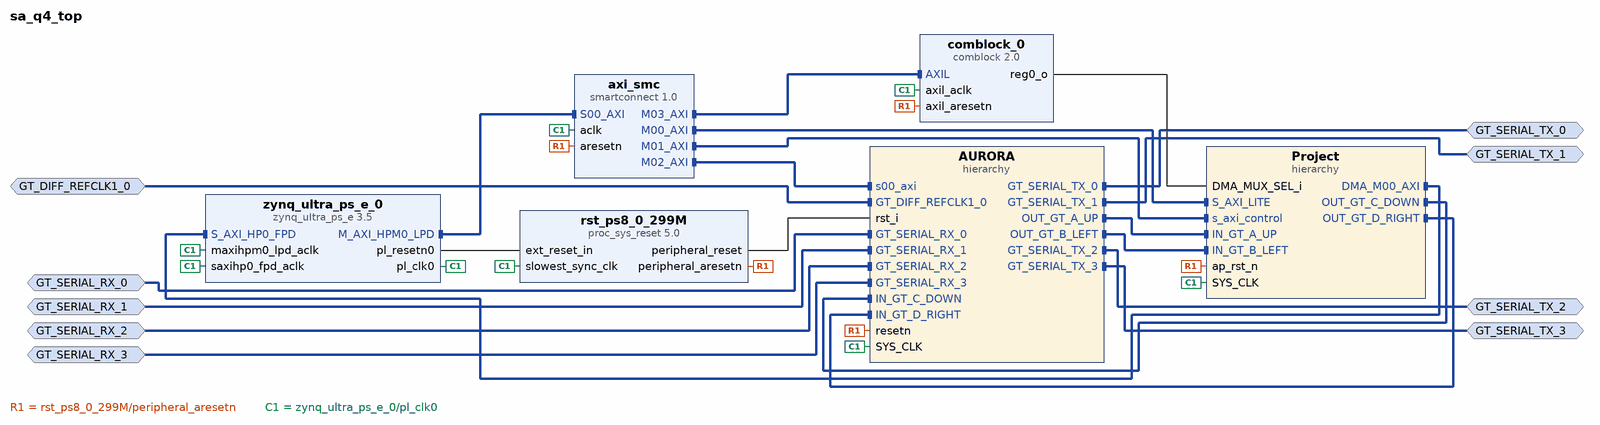
[diagram p0: block diagram of the top level]
# Vivado block design sa_q4_top, xczu4eg-sfvc784-2-e, Vivado 2024.2
create_bd_design sa_q4_top

create_bd_intf_port -mode Slave -vlnv xilinx.com:display_aurora:GT_Serial_Transceiver_Pins_RX_rtl:1.0 GT_SERIAL_RX_0
create_bd_intf_port -mode Master -vlnv xilinx.com:display_aurora:GT_Serial_Transceiver_Pins_TX_rtl:1.0 GT_SERIAL_TX_0
create_bd_intf_port -mode Slave -vlnv xilinx.com:display_aurora:GT_Serial_Transceiver_Pins_RX_rtl:1.0 GT_SERIAL_RX_1
create_bd_intf_port -mode Master -vlnv xilinx.com:display_aurora:GT_Serial_Transceiver_Pins_TX_rtl:1.0 GT_SERIAL_TX_1
create_bd_intf_port -mode Slave -vlnv xilinx.com:display_aurora:GT_Serial_Transceiver_Pins_RX_rtl:1.0 GT_SERIAL_RX_2
create_bd_intf_port -mode Master -vlnv xilinx.com:display_aurora:GT_Serial_Transceiver_Pins_TX_rtl:1.0 GT_SERIAL_TX_2
create_bd_intf_port -mode Slave -vlnv xilinx.com:display_aurora:GT_Serial_Transceiver_Pins_RX_rtl:1.0 GT_SERIAL_RX_3
create_bd_intf_port -mode Master -vlnv xilinx.com:display_aurora:GT_Serial_Transceiver_Pins_TX_rtl:1.0 GT_SERIAL_TX_3
create_bd_intf_port -mode Slave -vlnv xilinx.com:interface:diff_clock_rtl:1.0 GT_DIFF_REFCLK1_0
set_property -dict {CONFIG.FREQ_HZ 125000000} [get_bd_intf_ports GT_DIFF_REFCLK1_0]

create_bd_cell -type ip -vlnv xilinx.com:ip:proc_sys_reset:5.0 rst_ps8_0_299M
create_bd_cell -type ip -vlnv xilinx.com:ip:zynq_ultra_ps_e:3.5 zynq_ultra_ps_e_0
set_property -dict [list \
  CONFIG.PSU_BANK_0_IO_STANDARD LVCMOS18 \
  CONFIG.PSU_BANK_1_IO_STANDARD LVCMOS18 \
  CONFIG.PSU_BANK_2_IO_STANDARD LVCMOS18 \
  CONFIG.PSU_BANK_3_IO_STANDARD LVCMOS18 \
  CONFIG.PSU__CAN1__PERIPHERAL__ENABLE 1 \
  CONFIG.PSU__CAN1__PERIPHERAL__IO {MIO 52 .. 53} \
  CONFIG.PSU__CRF_APB__DDR_CTRL__FREQMHZ 1200 \
  CONFIG.PSU__CRF_APB__DP_AUDIO_REF_CTRL__SRCSEL VPLL \
  CONFIG.PSU__CRF_APB__DP_STC_REF_CTRL__SRCSEL VPLL \
  CONFIG.PSU__CRF_APB__DP_VIDEO_REF_CTRL__SRCSEL DPLL \
  CONFIG.PSU__CRF_APB__GPU_REF_CTRL__FREQMHZ 600 \
  CONFIG.PSU__CRF_APB__GPU_REF_CTRL__SRCSEL DPLL \
  CONFIG.PSU__CRF_APB__TOPSW_MAIN_CTRL__SRCSEL VPLL \
  CONFIG.PSU__CRL_APB__ADMA_REF_CTRL__SRCSEL IOPLL \
  CONFIG.PSU__CRL_APB__CAN1_REF_CTRL__SRCSEL IOPLL \
  CONFIG.PSU__CRL_APB__CPU_R5_CTRL__SRCSEL IOPLL \
  CONFIG.PSU__CRL_APB__IOU_SWITCH_CTRL__SRCSEL RPLL \
  CONFIG.PSU__CRL_APB__LPD_SWITCH_CTRL__SRCSEL IOPLL \
  CONFIG.PSU__CRL_APB__PL0_REF_CTRL__FREQMHZ 300 \
  CONFIG.PSU__CRL_APB__PL0_REF_CTRL__SRCSEL IOPLL \
  CONFIG.PSU__CRL_APB__SDIO1_REF_CTRL__SRCSEL RPLL \
  CONFIG.PSU__DDRC__DEVICE_CAPACITY {8192 MBits} \
  CONFIG.PSU__DDRC__DRAM_WIDTH {16 Bits} \
  CONFIG.PSU__DDRC__SPEED_BIN DDR4_2400P \
  CONFIG.PSU__DDR_HIGH_ADDRESS_GUI_ENABLE 1 \
  CONFIG.PSU__DDR__INTERFACE__FREQMHZ 600.000 \
  CONFIG.PSU__DLL__ISUSED 1 \
  CONFIG.PSU__ENET3__FIFO__ENABLE 0 \
  CONFIG.PSU__ENET3__GRP_MDIO__ENABLE 1 \
  CONFIG.PSU__ENET3__GRP_MDIO__IO {MIO 76 .. 77} \
  CONFIG.PSU__ENET3__PERIPHERAL__ENABLE 1 \
  CONFIG.PSU__ENET3__PERIPHERAL__IO {MIO 64 .. 75} \
  CONFIG.PSU__ENET3__PTP__ENABLE 0 \
  CONFIG.PSU__ENET3__TSU__ENABLE 0 \
  CONFIG.PSU__FPGA_PL0_ENABLE 1 \
  CONFIG.PSU__GEM3_COHERENCY 0 \
  CONFIG.PSU__GEM3_ROUTE_THROUGH_FPD 0 \
  CONFIG.PSU__GEM__TSU__ENABLE 0 \
  CONFIG.PSU__GPIO0_MIO__IO {MIO 0 .. 25} \
  CONFIG.PSU__GPIO0_MIO__PERIPHERAL__ENABLE 1 \
  CONFIG.PSU__GPIO1_MIO__IO {MIO 26 .. 51} \
  CONFIG.PSU__GPIO1_MIO__PERIPHERAL__ENABLE 1 \
  CONFIG.PSU__GPIO2_MIO__IO {MIO 52 .. 77} \
  CONFIG.PSU__GPIO2_MIO__PERIPHERAL__ENABLE 1 \
  CONFIG.PSU__I2C0__PERIPHERAL__ENABLE 1 \
  CONFIG.PSU__I2C0__PERIPHERAL__IO {MIO 38 .. 39} \
  CONFIG.PSU__I2C1__PERIPHERAL__ENABLE 0 \
  CONFIG.PSU__PCIE__BAR0_ENABLE 1 \
  CONFIG.PSU__PCIE__BAR0_SCALE Megabytes \
  CONFIG.PSU__PCIE__BAR0_SIZE 1 \
  CONFIG.PSU__PCIE__BAR0_TYPE Memory \
  CONFIG.PSU__PCIE__BAR0_VAL 0xfff00000 \
  CONFIG.PSU__PCIE__BAR1_VAL 0x0 \
  CONFIG.PSU__PCIE__BAR2_VAL 0x0 \
  CONFIG.PSU__PCIE__BAR3_VAL 0x0 \
  CONFIG.PSU__PCIE__BAR4_VAL 0x0 \
  CONFIG.PSU__PCIE__BAR5_VAL 0x0 \
  CONFIG.PSU__PCIE__BRIDGE_BAR_INDICATOR {BAR 0} \
  CONFIG.PSU__PCIE__CLASS_CODE_BASE 0x05 \
  CONFIG.PSU__PCIE__CLASS_CODE_INTERFACE 0x0 \
  CONFIG.PSU__PCIE__CLASS_CODE_SUB 0x04 \
  CONFIG.PSU__PCIE__CLASS_CODE_VALUE 0x50400 \
  CONFIG.PSU__PCIE__DEVICE_ID 0xD021 \
  CONFIG.PSU__PCIE__DEVICE_PORT_TYPE {Endpoint Device} \
  CONFIG.PSU__PCIE__EROM_VAL 0x0 \
  CONFIG.PSU__PCIE__INTX_GENERATION 1 \
  CONFIG.PSU__PCIE__INTX_PIN INTA \
  CONFIG.PSU__PCIE__LANE0__ENABLE 1 \
  CONFIG.PSU__PCIE__LANE0__IO {GT Lane0} \
  CONFIG.PSU__PCIE__LANE1__ENABLE 1 \
  CONFIG.PSU__PCIE__LANE1__IO {GT Lane1} \
  CONFIG.PSU__PCIE__LANE2__ENABLE 1 \
  CONFIG.PSU__PCIE__LANE2__IO {GT Lane2} \
  CONFIG.PSU__PCIE__LANE3__ENABLE 1 \
  CONFIG.PSU__PCIE__LANE3__IO {GT Lane3} \
  CONFIG.PSU__PCIE__LINK_SPEED {5.0 Gb/s} \
  CONFIG.PSU__PCIE__MAXIMUM_LINK_WIDTH x4 \
  CONFIG.PSU__PCIE__MAX_PAYLOAD_SIZE {256 bytes} \
  CONFIG.PSU__PCIE__MSIX_BAR_INDICATOR {BAR 0} \
  CONFIG.PSU__PCIE__MSIX_PBA_BAR_INDICATOR {BAR 0} \
  CONFIG.PSU__PCIE__PERIPHERAL__ENABLE 1 \
  CONFIG.PSU__PCIE__PERIPHERAL__ENDPOINT_IO {MIO 37} \
  CONFIG.PSU__PCIE__REF_CLK_FREQ 100 \
  CONFIG.PSU__PCIE__REF_CLK_SEL {Ref Clk0} \
  CONFIG.PSU__PCIE__REVISION_ID 0x0 \
  CONFIG.PSU__PCIE__SUBSYSTEM_ID 0x7 \
  CONFIG.PSU__PCIE__SUBSYSTEM_VENDOR_ID 0x10EE \
  CONFIG.PSU__PCIE__VENDOR_ID 0x10EE \
  CONFIG.PSU__PRESET_APPLIED 1 \
  CONFIG.PSU__PSS_REF_CLK__FREQMHZ 33.33333 \
  CONFIG.PSU__QSPI_COHERENCY 0 \
  CONFIG.PSU__QSPI_ROUTE_THROUGH_FPD 0 \
  CONFIG.PSU__QSPI__GRP_FBCLK__ENABLE 1 \
  CONFIG.PSU__QSPI__GRP_FBCLK__IO {MIO 6} \
  CONFIG.PSU__QSPI__PERIPHERAL__DATA_MODE x4 \
  CONFIG.PSU__QSPI__PERIPHERAL__ENABLE 1 \
  CONFIG.PSU__QSPI__PERIPHERAL__IO {MIO 0 .. 12} \
  CONFIG.PSU__QSPI__PERIPHERAL__MODE {Dual Parallel} \
  CONFIG.PSU__SD1_COHERENCY 0 \
  CONFIG.PSU__SD1_ROUTE_THROUGH_FPD 0 \
  CONFIG.PSU__SD1__CLK_50_SDR_ITAP_DLY 0x15 \
  CONFIG.PSU__SD1__CLK_50_SDR_OTAP_DLY 0x5 \
  CONFIG.PSU__SD1__DATA_TRANSFER_MODE 4Bit \
  CONFIG.PSU__SD1__GRP_CD__ENABLE 1 \
  CONFIG.PSU__SD1__GRP_CD__IO {MIO 45} \
  CONFIG.PSU__SD1__GRP_POW__ENABLE 0 \
  CONFIG.PSU__SD1__GRP_WP__ENABLE 0 \
  CONFIG.PSU__SD1__PERIPHERAL__ENABLE 1 \
  CONFIG.PSU__SD1__PERIPHERAL__IO {MIO 46 .. 51} \
  CONFIG.PSU__SD1__SLOT_TYPE {SD 2.0} \
  CONFIG.PSU__SWDT0__CLOCK__ENABLE 0 \
  CONFIG.PSU__SWDT0__PERIPHERAL__ENABLE 1 \
  CONFIG.PSU__SWDT0__RESET__ENABLE 0 \
  CONFIG.PSU__SWDT1__CLOCK__ENABLE 0 \
  CONFIG.PSU__SWDT1__PERIPHERAL__ENABLE 1 \
  CONFIG.PSU__SWDT1__RESET__ENABLE 0 \
  CONFIG.PSU__TSU__BUFG_PORT_PAIR 0 \
  CONFIG.PSU__TTC0__CLOCK__ENABLE 0 \
  CONFIG.PSU__TTC0__PERIPHERAL__ENABLE 1 \
  CONFIG.PSU__TTC0__WAVEOUT__ENABLE 0 \
  CONFIG.PSU__TTC1__CLOCK__ENABLE 0 \
  CONFIG.PSU__TTC1__PERIPHERAL__ENABLE 1 \
  CONFIG.PSU__TTC1__WAVEOUT__ENABLE 0 \
  CONFIG.PSU__TTC2__CLOCK__ENABLE 0 \
  CONFIG.PSU__TTC2__PERIPHERAL__ENABLE 1 \
  CONFIG.PSU__TTC2__WAVEOUT__ENABLE 0 \
  CONFIG.PSU__TTC3__CLOCK__ENABLE 0 \
  CONFIG.PSU__TTC3__PERIPHERAL__ENABLE 1 \
  CONFIG.PSU__TTC3__WAVEOUT__ENABLE 0 \
  CONFIG.PSU__UART0__BAUD_RATE 115200 \
  CONFIG.PSU__UART0__MODEM__ENABLE 0 \
  CONFIG.PSU__UART0__PERIPHERAL__ENABLE 1 \
  CONFIG.PSU__UART0__PERIPHERAL__IO {MIO 42 .. 43} \
  CONFIG.PSU__USB0__PERIPHERAL__ENABLE 0 \
  CONFIG.PSU__USE__S_AXI_GP2 1 \
] [get_bd_cells zynq_ultra_ps_e_0]
# 394 more settings of zynq_ultra_ps_e_0 are not shown: defaults, MIO pin electricals, DDR timing, and values the tool derives
create_bd_cell -type hier AURORA
create_bd_cell -type hier Project
create_bd_cell -type ip -vlnv xilinx.com:ip:smartconnect:1.0 axi_smc
set_property -dict {CONFIG.NUM_MI 5 CONFIG.NUM_SI 1} [get_bd_cells axi_smc]
create_bd_cell -type ip -vlnv www.ictp.it:user:comblock:2.0 comblock_0
set_property -dict {CONFIG.DRAM_IO_ENA false CONFIG.FIFO_IN_ENA false} [get_bd_cells comblock_0]

# ---- hierarchy /AURORA ----
current_bd_instance /AURORA
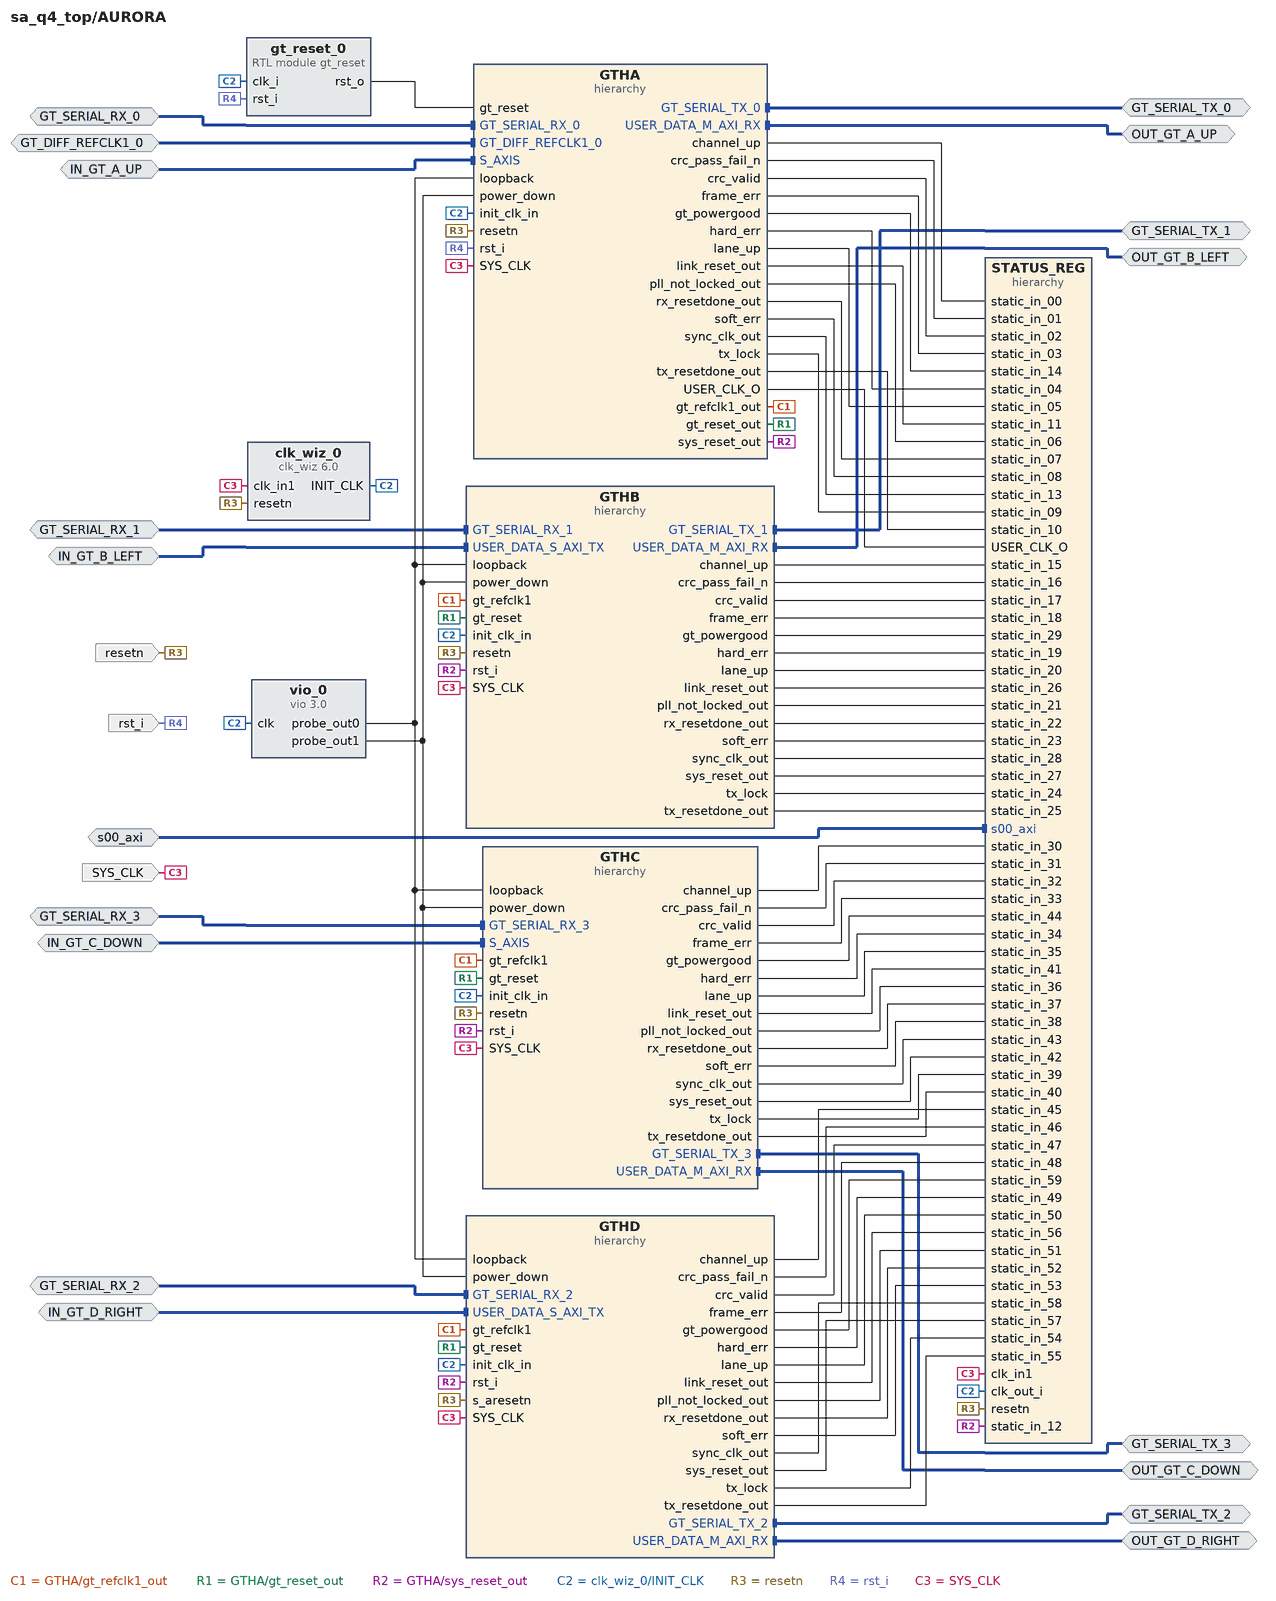
[diagram p1: block diagram inside /AURORA]
create_bd_intf_pin -mode Slave -vlnv xilinx.com:display_aurora:GT_Serial_Transceiver_Pins_RX_rtl:1.0 GT_SERIAL_RX_0
create_bd_intf_pin -mode Master -vlnv xilinx.com:display_aurora:GT_Serial_Transceiver_Pins_TX_rtl:1.0 GT_SERIAL_TX_0
create_bd_intf_pin -mode Slave -vlnv xilinx.com:display_aurora:GT_Serial_Transceiver_Pins_RX_rtl:1.0 GT_SERIAL_RX_1
create_bd_intf_pin -mode Master -vlnv xilinx.com:display_aurora:GT_Serial_Transceiver_Pins_TX_rtl:1.0 GT_SERIAL_TX_1
create_bd_intf_pin -mode Slave -vlnv xilinx.com:display_aurora:GT_Serial_Transceiver_Pins_RX_rtl:1.0 GT_SERIAL_RX_2
create_bd_intf_pin -mode Master -vlnv xilinx.com:display_aurora:GT_Serial_Transceiver_Pins_TX_rtl:1.0 GT_SERIAL_TX_2
create_bd_intf_pin -mode Slave -vlnv xilinx.com:display_aurora:GT_Serial_Transceiver_Pins_RX_rtl:1.0 GT_SERIAL_RX_3
create_bd_intf_pin -mode Master -vlnv xilinx.com:display_aurora:GT_Serial_Transceiver_Pins_TX_rtl:1.0 GT_SERIAL_TX_3
create_bd_intf_pin -mode Slave -vlnv xilinx.com:interface:diff_clock_rtl:1.0 GT_DIFF_REFCLK1_0
create_bd_intf_pin -mode Slave -vlnv xilinx.com:interface:axis_rtl:1.0 IN_GT_D_RIGHT
create_bd_intf_pin -mode Slave -vlnv xilinx.com:interface:axis_rtl:1.0 IN_GT_B_LEFT
create_bd_intf_pin -mode Slave -vlnv xilinx.com:interface:axis_rtl:1.0 IN_GT_C_DOWN
create_bd_intf_pin -mode Slave -vlnv xilinx.com:interface:axis_rtl:1.0 IN_GT_A_UP
create_bd_intf_pin -mode Master -vlnv xilinx.com:interface:axis_rtl:1.0 OUT_GT_A_UP
create_bd_intf_pin -mode Master -vlnv xilinx.com:interface:axis_rtl:1.0 OUT_GT_B_LEFT
create_bd_intf_pin -mode Master -vlnv xilinx.com:interface:axis_rtl:1.0 OUT_GT_C_DOWN
create_bd_intf_pin -mode Master -vlnv xilinx.com:interface:axis_rtl:1.0 OUT_GT_D_RIGHT
create_bd_intf_pin -mode Slave -vlnv xilinx.com:interface:aximm_rtl:1.0 s00_axi
create_bd_pin -dir I -type rst resetn
create_bd_pin -dir I rst_i
create_bd_pin -dir I -type clk SYS_CLK

create_bd_cell -type ip -vlnv xilinx.com:ip:clk_wiz:6.0 clk_wiz_0
set_property -dict [list \
  CONFIG.CLKOUT1_JITTER 191.759 \
  CONFIG.CLKOUT1_PHASE_ERROR 348.339 \
  CONFIG.CLKOUT1_REQUESTED_OUT_FREQ 156.25 \
  CONFIG.CLK_OUT1_PORT INIT_CLK \
  CONFIG.MMCM_CLKFBOUT_MULT_F 96.875 \
  CONFIG.MMCM_CLKOUT0_DIVIDE_F 7.750 \
  CONFIG.MMCM_DIVCLK_DIVIDE 24 \
  CONFIG.RESET_PORT resetn \
  CONFIG.RESET_TYPE ACTIVE_LOW \
] [get_bd_cells clk_wiz_0]
create_bd_cell -type module -reference gt_reset gt_reset_0
create_bd_cell -type ip -vlnv xilinx.com:ip:vio:3.0 vio_0
set_property -dict {CONFIG.C_NUM_PROBE_IN 0 CONFIG.C_NUM_PROBE_OUT 2} [get_bd_cells vio_0]
create_bd_cell -type hier STATUS_REG
create_bd_cell -type hier GTHB
create_bd_cell -type hier GTHC
create_bd_cell -type hier GTHA
create_bd_cell -type hier GTHD

# ---- hierarchy /AURORA/STATUS_REG ----
current_bd_instance /AURORA/STATUS_REG
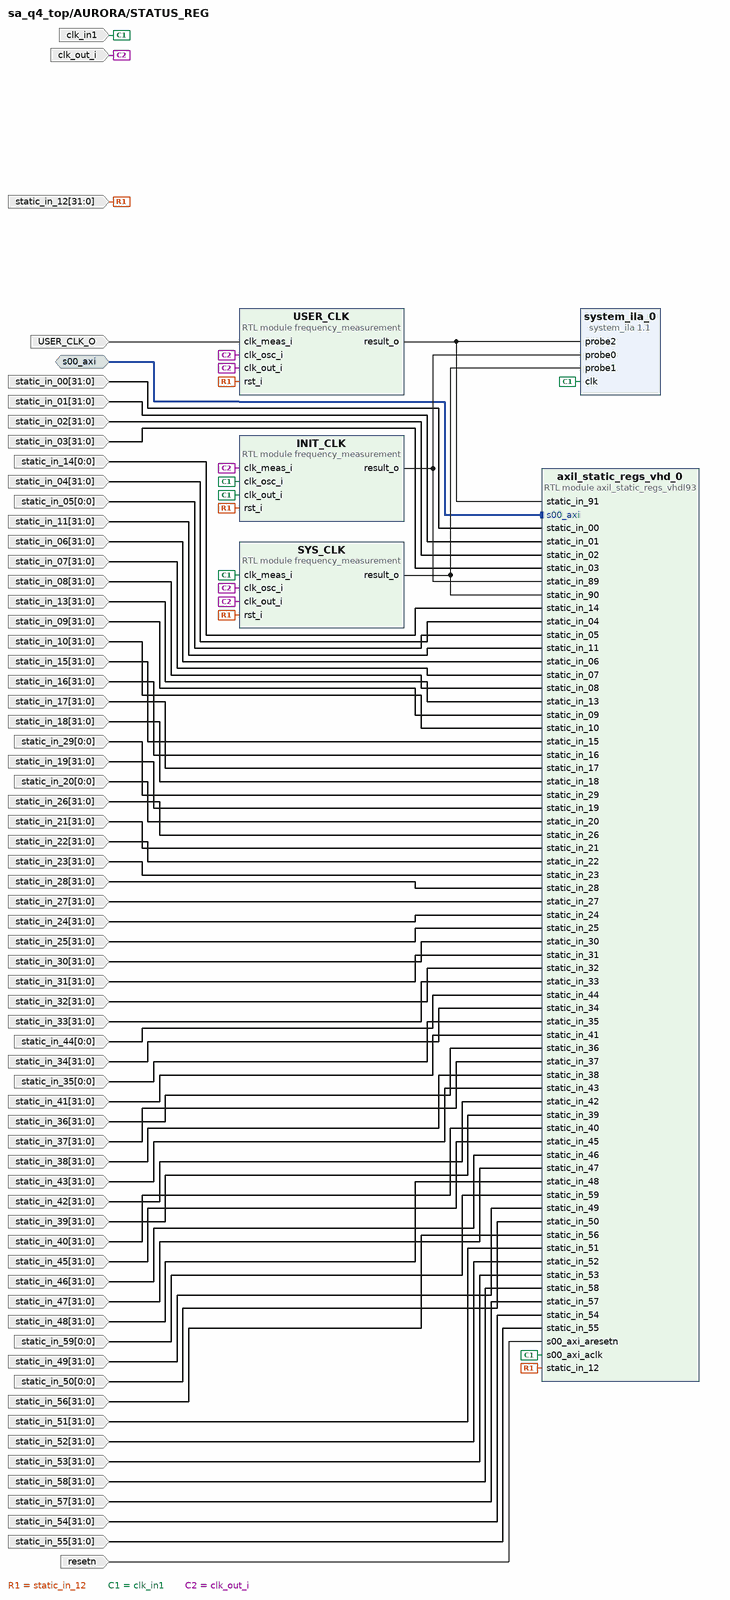
[diagram p2: block diagram inside /AURORA/STATUS_REG]
create_bd_intf_pin -mode Slave -vlnv xilinx.com:interface:aximm_rtl:1.0 s00_axi
create_bd_pin -dir I -from 31 -to 0 static_in_00
create_bd_pin -dir I -from 31 -to 0 static_in_01
create_bd_pin -dir I -from 31 -to 0 static_in_02
create_bd_pin -dir I -from 31 -to 0 static_in_03
create_bd_pin -dir I -from 31 -to 0 static_in_04
create_bd_pin -dir I -from 0 -to 0 static_in_05
create_bd_pin -dir I -from 31 -to 0 static_in_06
create_bd_pin -dir I -from 31 -to 0 static_in_07
create_bd_pin -dir I -from 31 -to 0 static_in_08
create_bd_pin -dir I -from 31 -to 0 static_in_09
create_bd_pin -dir I -from 31 -to 0 static_in_10
create_bd_pin -dir I -from 31 -to 0 static_in_11
create_bd_pin -dir I -from 31 -to 0 static_in_12
create_bd_pin -dir I -from 31 -to 0 static_in_13
create_bd_pin -dir I -from 0 -to 0 static_in_14
create_bd_pin -dir I -from 31 -to 0 static_in_15
create_bd_pin -dir I -from 31 -to 0 static_in_16
create_bd_pin -dir I -from 31 -to 0 static_in_17
create_bd_pin -dir I -from 31 -to 0 static_in_18
create_bd_pin -dir I -from 31 -to 0 static_in_19
create_bd_pin -dir I -from 0 -to 0 static_in_20
create_bd_pin -dir I -from 31 -to 0 static_in_21
create_bd_pin -dir I -from 31 -to 0 static_in_22
create_bd_pin -dir I -from 31 -to 0 static_in_23
create_bd_pin -dir I -from 31 -to 0 static_in_24
create_bd_pin -dir I -from 31 -to 0 static_in_25
create_bd_pin -dir I -from 31 -to 0 static_in_26
create_bd_pin -dir I -from 31 -to 0 static_in_27
create_bd_pin -dir I -from 31 -to 0 static_in_28
create_bd_pin -dir I -from 0 -to 0 static_in_29
create_bd_pin -dir I -from 31 -to 0 static_in_30
create_bd_pin -dir I -from 31 -to 0 static_in_31
create_bd_pin -dir I -from 31 -to 0 static_in_32
create_bd_pin -dir I -from 31 -to 0 static_in_33
create_bd_pin -dir I -from 31 -to 0 static_in_34
create_bd_pin -dir I -from 0 -to 0 static_in_35
create_bd_pin -dir I -from 31 -to 0 static_in_36
create_bd_pin -dir I -from 31 -to 0 static_in_37
create_bd_pin -dir I -from 31 -to 0 static_in_38
create_bd_pin -dir I -from 31 -to 0 static_in_39
create_bd_pin -dir I -from 31 -to 0 static_in_40
create_bd_pin -dir I -from 31 -to 0 static_in_41
create_bd_pin -dir I -from 31 -to 0 static_in_42
create_bd_pin -dir I -from 31 -to 0 static_in_43
create_bd_pin -dir I -from 0 -to 0 static_in_44
create_bd_pin -dir I -from 31 -to 0 static_in_45
create_bd_pin -dir I -from 31 -to 0 static_in_46
create_bd_pin -dir I -from 31 -to 0 static_in_47
create_bd_pin -dir I -from 31 -to 0 static_in_48
create_bd_pin -dir I -from 31 -to 0 static_in_49
create_bd_pin -dir I -from 0 -to 0 static_in_50
create_bd_pin -dir I -from 31 -to 0 static_in_51
create_bd_pin -dir I -from 31 -to 0 static_in_52
create_bd_pin -dir I -from 31 -to 0 static_in_53
create_bd_pin -dir I -from 31 -to 0 static_in_54
create_bd_pin -dir I -from 31 -to 0 static_in_55
create_bd_pin -dir I -from 31 -to 0 static_in_56
create_bd_pin -dir I -from 31 -to 0 static_in_57
create_bd_pin -dir I -from 31 -to 0 static_in_58
create_bd_pin -dir I -from 0 -to 0 static_in_59
create_bd_pin -dir I -type clk clk_in1
create_bd_pin -dir I -type rst resetn
create_bd_pin -dir I clk_out_i
create_bd_pin -dir I USER_CLK_O

create_bd_cell -type module -reference axil_static_regs_vhdl93 axil_static_regs_vhd_0
create_bd_cell -type module -reference frequency_measurement USER_CLK
set_property -dict {CONFIG.CLK_OSC_FREQUENCY 156250000} [get_bd_cells USER_CLK]
create_bd_cell -type module -reference frequency_measurement SYS_CLK
set_property -dict {CONFIG.CLK_OSC_FREQUENCY 156250000} [get_bd_cells SYS_CLK]
create_bd_cell -type module -reference frequency_measurement INIT_CLK
set_property -dict {CONFIG.CLK_OSC_FREQUENCY 300000000} [get_bd_cells INIT_CLK]
create_bd_cell -type ip -vlnv xilinx.com:ip:system_ila:1.1 system_ila_0
set_property -dict [list \
  CONFIG.C_MON_TYPE NATIVE \
  CONFIG.C_NUM_OF_PROBES 3 \
  CONFIG.C_PROBE0_TYPE 0 \
  CONFIG.C_PROBE1_TYPE 0 \
  CONFIG.C_PROBE2_TYPE 0 \
] [get_bd_cells system_ila_0]

# ---- hierarchy /AURORA/GTHB ----
current_bd_instance /AURORA/GTHB
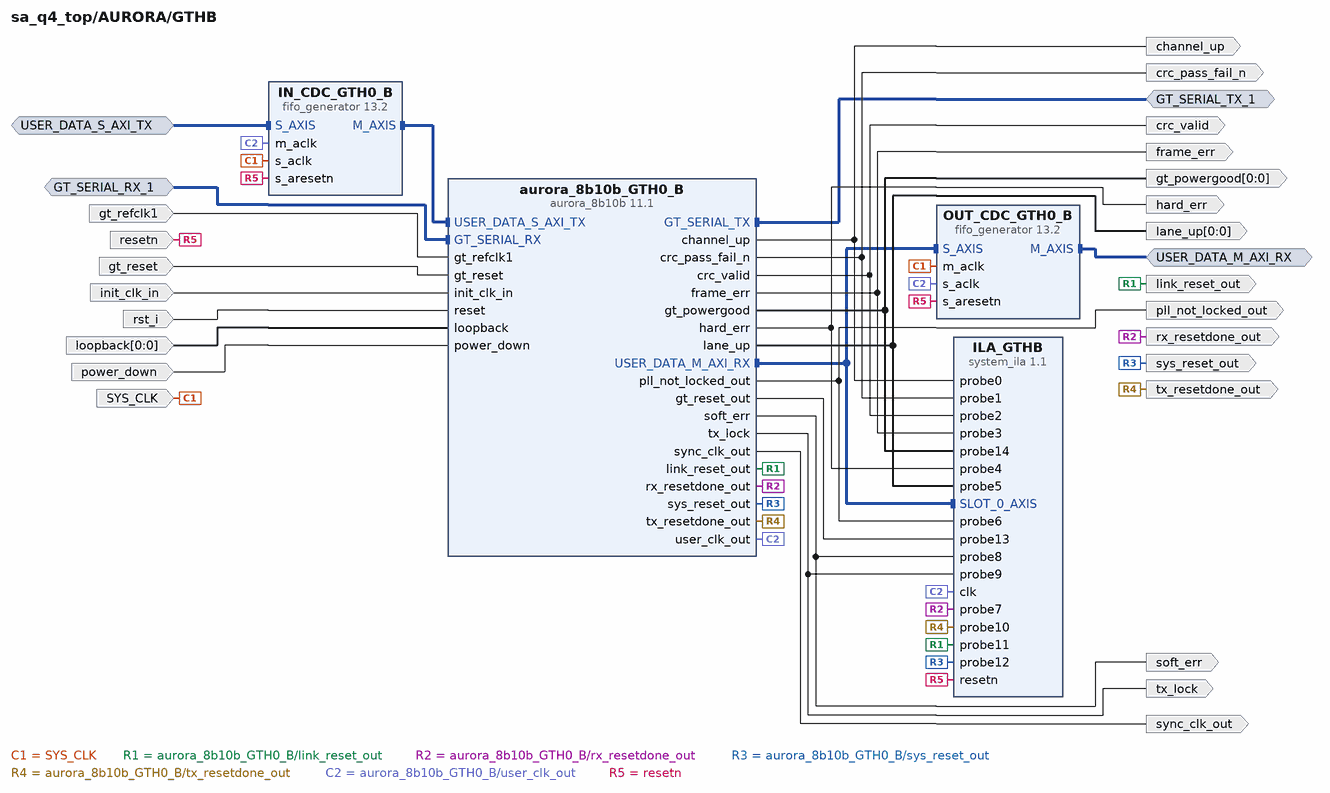
[diagram p3: block diagram inside /AURORA/GTHB]
create_bd_intf_pin -mode Slave -vlnv xilinx.com:interface:axis_rtl:1.0 USER_DATA_S_AXI_TX
create_bd_intf_pin -mode Master -vlnv xilinx.com:interface:axis_rtl:1.0 USER_DATA_M_AXI_RX
create_bd_intf_pin -mode Master -vlnv xilinx.com:display_aurora:GT_Serial_Transceiver_Pins_TX_rtl:1.0 GT_SERIAL_TX_1
create_bd_intf_pin -mode Slave -vlnv xilinx.com:display_aurora:GT_Serial_Transceiver_Pins_RX_rtl:1.0 GT_SERIAL_RX_1
create_bd_pin -dir O hard_err
create_bd_pin -dir O soft_err
create_bd_pin -dir O frame_err
create_bd_pin -dir O channel_up
create_bd_pin -dir O -from 0 -to 0 lane_up
create_bd_pin -dir I rst_i
create_bd_pin -dir I -type rst gt_reset
create_bd_pin -dir I -from 0 -to 0 loopback
create_bd_pin -dir O crc_valid
create_bd_pin -dir O crc_pass_fail_n
create_bd_pin -dir I -type rst power_down
create_bd_pin -dir O tx_lock
create_bd_pin -dir O tx_resetdone_out
create_bd_pin -dir O rx_resetdone_out
create_bd_pin -dir O -type rst link_reset_out
create_bd_pin -dir I -type clk init_clk_in
create_bd_pin -dir O pll_not_locked_out
create_bd_pin -dir O -type rst sys_reset_out
create_bd_pin -dir I -type clk gt_refclk1
create_bd_pin -dir O -type clk sync_clk_out
create_bd_pin -dir O -from 0 -to 0 gt_powergood
create_bd_pin -dir I -type clk SYS_CLK
create_bd_pin -dir I -type rst resetn

create_bd_cell -type ip -vlnv xilinx.com:ip:aurora_8b10b:11.1 aurora_8b10b_GTH0_B
set_property -dict [list \
  CONFIG.C_DRP_IF false \
  CONFIG.C_LANE_WIDTH 4 \
  CONFIG.C_LINE_RATE 6.25 \
  CONFIG.C_REFCLK_SOURCE {MGTREFCLK1 of Quad X0Y1} \
  CONFIG.C_START_LANE X0Y5 \
  CONFIG.C_USE_CRC true \
  CONFIG.Flow_Mode None \
  CONFIG.SINGLEEND_GTREFCLK true \
  CONFIG.SupportLevel 1 \
] [get_bd_cells aurora_8b10b_GTH0_B]
create_bd_cell -type ip -vlnv xilinx.com:ip:fifo_generator:13.2 IN_CDC_GTH0_B
set_property -dict [list \
  CONFIG.Clock_Type_AXI Independent_Clock \
  CONFIG.Enable_TLAST true \
  CONFIG.HAS_TKEEP true \
  CONFIG.INTERFACE_TYPE AXI_STREAM \
  CONFIG.TDATA_NUM_BYTES 4 \
  CONFIG.TUSER_WIDTH 0 \
] [get_bd_cells IN_CDC_GTH0_B]
create_bd_cell -type ip -vlnv xilinx.com:ip:fifo_generator:13.2 OUT_CDC_GTH0_B
set_property -dict [list \
  CONFIG.Clock_Type_AXI Independent_Clock \
  CONFIG.Enable_TLAST true \
  CONFIG.HAS_TKEEP true \
  CONFIG.INTERFACE_TYPE AXI_STREAM \
  CONFIG.TDATA_NUM_BYTES 4 \
  CONFIG.TUSER_WIDTH 0 \
] [get_bd_cells OUT_CDC_GTH0_B]
create_bd_cell -type ip -vlnv xilinx.com:ip:system_ila:1.1 ILA_GTHB
set_property -dict [list \
  CONFIG.C_MON_TYPE MIX \
  CONFIG.C_NUM_MONITOR_SLOTS 1 \
  CONFIG.C_NUM_OF_PROBES 15 \
  CONFIG.C_PROBE0_TYPE 0 \
  CONFIG.C_PROBE10_TYPE 0 \
  CONFIG.C_PROBE11_TYPE 0 \
  CONFIG.C_PROBE12_TYPE 0 \
  CONFIG.C_PROBE13_TYPE 0 \
  CONFIG.C_PROBE14_TYPE 0 \
  CONFIG.C_PROBE1_TYPE 0 \
  CONFIG.C_PROBE2_TYPE 0 \
  CONFIG.C_PROBE3_TYPE 0 \
  CONFIG.C_PROBE4_TYPE 0 \
  CONFIG.C_PROBE5_TYPE 0 \
  CONFIG.C_PROBE6_TYPE 0 \
  CONFIG.C_PROBE7_TYPE 0 \
  CONFIG.C_PROBE8_TYPE 0 \
  CONFIG.C_PROBE9_TYPE 0 \
  CONFIG.C_SLOT_0_APC_EN 0 \
  CONFIG.C_SLOT_0_AXI_DATA_SEL 1 \
  CONFIG.C_SLOT_0_AXI_TRIG_SEL 1 \
  CONFIG.C_SLOT_0_INTF_TYPE xilinx.com:interface:axis_rtl:1.0 \
] [get_bd_cells ILA_GTHB]

# ---- hierarchy /AURORA/GTHC ----
current_bd_instance /AURORA/GTHC
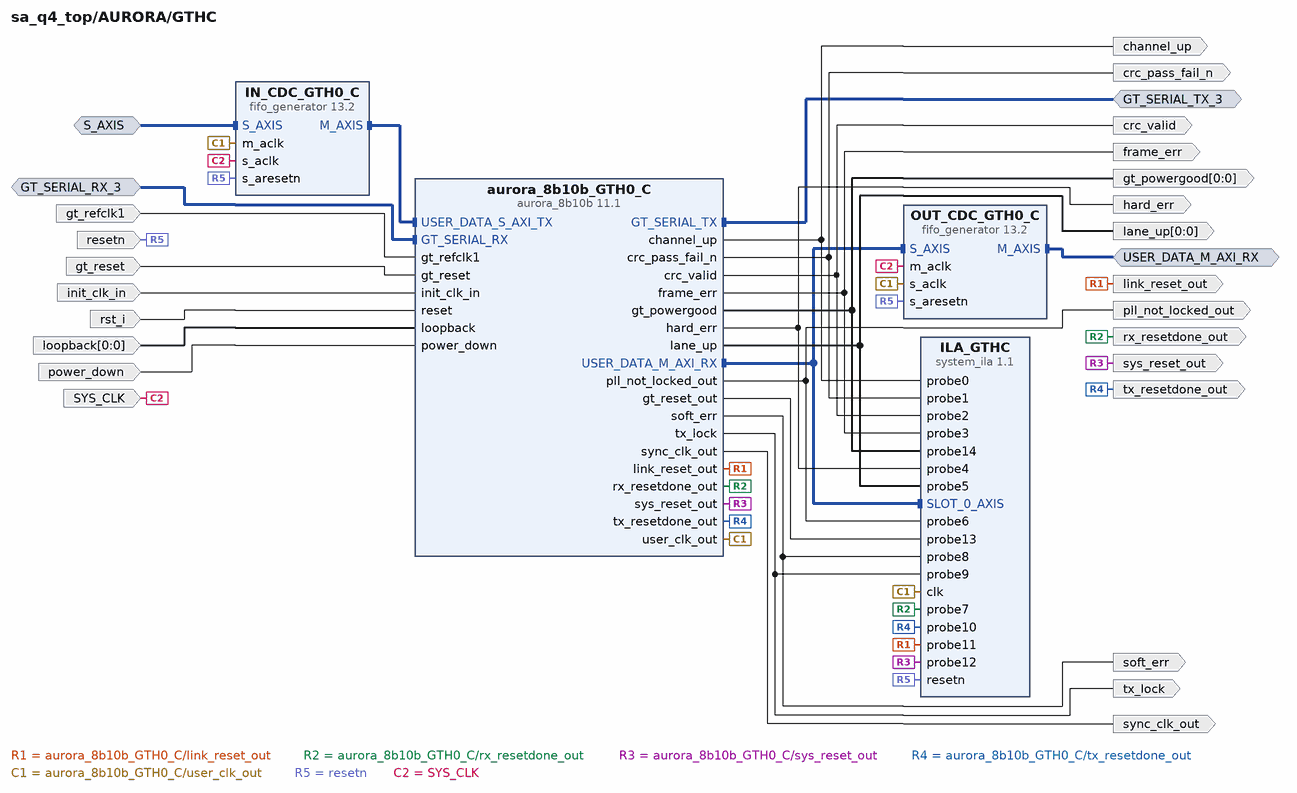
[diagram p4: block diagram inside /AURORA/GTHC]
create_bd_intf_pin -mode Master -vlnv xilinx.com:interface:axis_rtl:1.0 USER_DATA_M_AXI_RX
create_bd_intf_pin -mode Master -vlnv xilinx.com:display_aurora:GT_Serial_Transceiver_Pins_TX_rtl:1.0 GT_SERIAL_TX_3
create_bd_intf_pin -mode Slave -vlnv xilinx.com:display_aurora:GT_Serial_Transceiver_Pins_RX_rtl:1.0 GT_SERIAL_RX_3
create_bd_intf_pin -mode Slave -vlnv xilinx.com:interface:axis_rtl:1.0 S_AXIS
create_bd_pin -dir O hard_err
create_bd_pin -dir O soft_err
create_bd_pin -dir O frame_err
create_bd_pin -dir O channel_up
create_bd_pin -dir O -from 0 -to 0 lane_up
create_bd_pin -dir I rst_i
create_bd_pin -dir I -type rst gt_reset
create_bd_pin -dir I -from 0 -to 0 loopback
create_bd_pin -dir O crc_valid
create_bd_pin -dir O crc_pass_fail_n
create_bd_pin -dir I -type rst power_down
create_bd_pin -dir O tx_lock
create_bd_pin -dir O tx_resetdone_out
create_bd_pin -dir O rx_resetdone_out
create_bd_pin -dir O -type rst link_reset_out
create_bd_pin -dir I -type clk init_clk_in
create_bd_pin -dir O pll_not_locked_out
create_bd_pin -dir O -type rst sys_reset_out
create_bd_pin -dir I -type clk gt_refclk1
create_bd_pin -dir O -type clk sync_clk_out
create_bd_pin -dir O -from 0 -to 0 gt_powergood
create_bd_pin -dir I -type clk SYS_CLK
create_bd_pin -dir I -type rst resetn

create_bd_cell -type ip -vlnv xilinx.com:ip:aurora_8b10b:11.1 aurora_8b10b_GTH0_C
set_property -dict [list \
  CONFIG.C_DRP_IF false \
  CONFIG.C_LANE_WIDTH 4 \
  CONFIG.C_LINE_RATE 6.25 \
  CONFIG.C_REFCLK_SOURCE {MGTREFCLK1 of Quad X0Y1} \
  CONFIG.C_START_LANE X0Y6 \
  CONFIG.C_USE_CRC true \
  CONFIG.Flow_Mode None \
  CONFIG.SINGLEEND_GTREFCLK true \
  CONFIG.SupportLevel 1 \
] [get_bd_cells aurora_8b10b_GTH0_C]
create_bd_cell -type ip -vlnv xilinx.com:ip:fifo_generator:13.2 IN_CDC_GTH0_C
set_property -dict [list \
  CONFIG.Clock_Type_AXI Independent_Clock \
  CONFIG.Enable_TLAST true \
  CONFIG.HAS_TKEEP true \
  CONFIG.INTERFACE_TYPE AXI_STREAM \
  CONFIG.TDATA_NUM_BYTES 4 \
  CONFIG.TUSER_WIDTH 0 \
] [get_bd_cells IN_CDC_GTH0_C]
create_bd_cell -type ip -vlnv xilinx.com:ip:fifo_generator:13.2 OUT_CDC_GTH0_C
set_property -dict [list \
  CONFIG.Clock_Type_AXI Independent_Clock \
  CONFIG.Enable_TLAST true \
  CONFIG.HAS_TKEEP true \
  CONFIG.INTERFACE_TYPE AXI_STREAM \
  CONFIG.TDATA_NUM_BYTES 4 \
  CONFIG.TUSER_WIDTH 0 \
] [get_bd_cells OUT_CDC_GTH0_C]
create_bd_cell -type ip -vlnv xilinx.com:ip:system_ila:1.1 ILA_GTHC
set_property -dict [list \
  CONFIG.C_MON_TYPE MIX \
  CONFIG.C_NUM_MONITOR_SLOTS 1 \
  CONFIG.C_NUM_OF_PROBES 15 \
  CONFIG.C_PROBE0_TYPE 0 \
  CONFIG.C_PROBE10_TYPE 0 \
  CONFIG.C_PROBE11_TYPE 0 \
  CONFIG.C_PROBE12_TYPE 0 \
  CONFIG.C_PROBE13_TYPE 0 \
  CONFIG.C_PROBE14_TYPE 0 \
  CONFIG.C_PROBE1_TYPE 0 \
  CONFIG.C_PROBE2_TYPE 0 \
  CONFIG.C_PROBE3_TYPE 0 \
  CONFIG.C_PROBE4_TYPE 0 \
  CONFIG.C_PROBE5_TYPE 0 \
  CONFIG.C_PROBE6_TYPE 0 \
  CONFIG.C_PROBE7_TYPE 0 \
  CONFIG.C_PROBE8_TYPE 0 \
  CONFIG.C_PROBE9_TYPE 0 \
  CONFIG.C_SLOT_0_APC_EN 0 \
  CONFIG.C_SLOT_0_AXI_DATA_SEL 1 \
  CONFIG.C_SLOT_0_AXI_TRIG_SEL 1 \
  CONFIG.C_SLOT_0_INTF_TYPE xilinx.com:interface:axis_rtl:1.0 \
] [get_bd_cells ILA_GTHC]

# ---- hierarchy /AURORA/GTHA ----
current_bd_instance /AURORA/GTHA
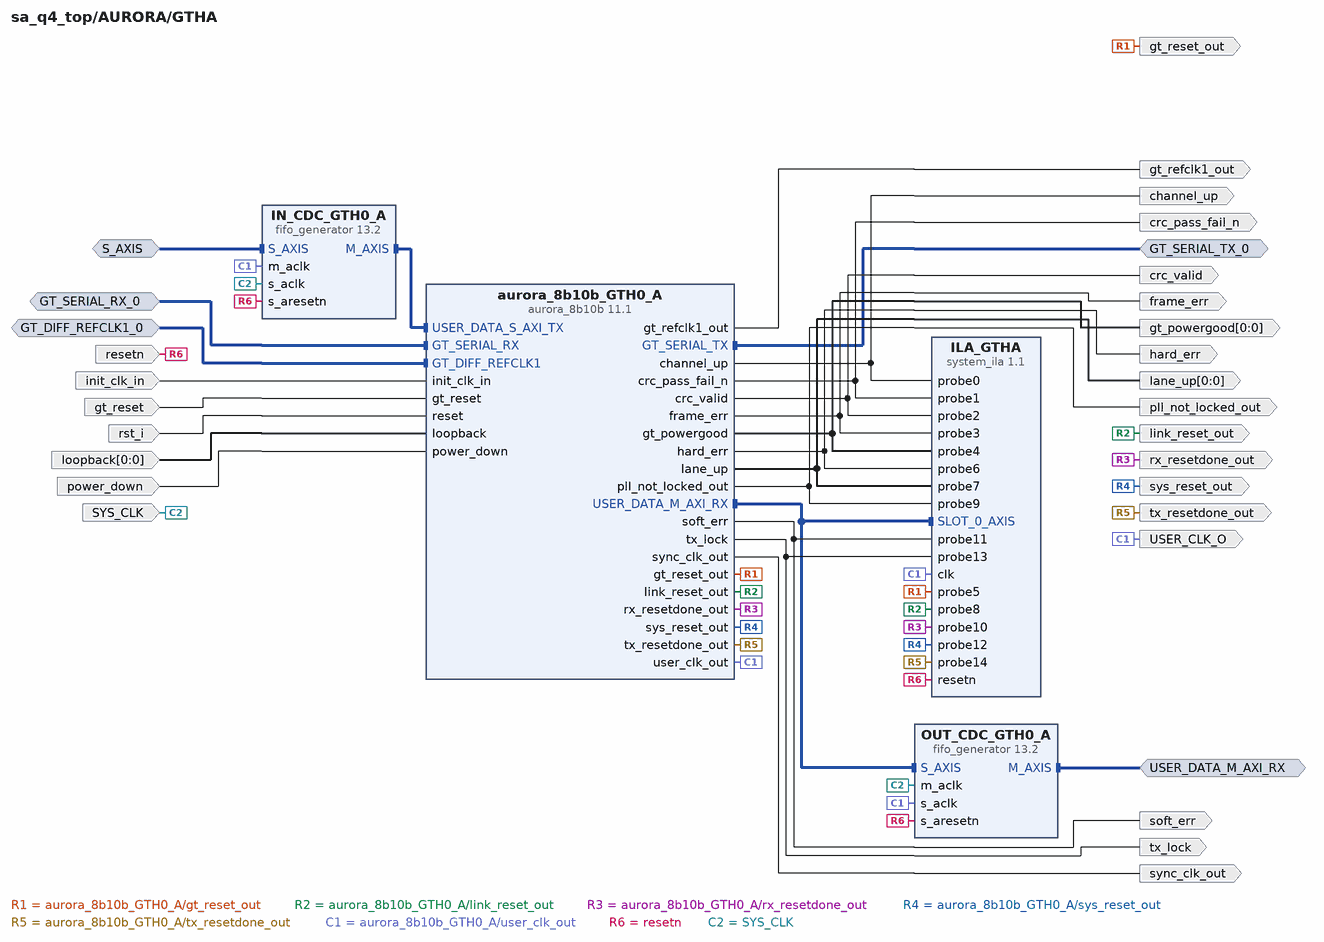
[diagram p5: block diagram inside /AURORA/GTHA]
create_bd_intf_pin -mode Slave -vlnv xilinx.com:interface:axis_rtl:1.0 S_AXIS
create_bd_intf_pin -mode Master -vlnv xilinx.com:interface:axis_rtl:1.0 USER_DATA_M_AXI_RX
create_bd_intf_pin -mode Slave -vlnv xilinx.com:interface:diff_clock_rtl:1.0 GT_DIFF_REFCLK1_0
create_bd_intf_pin -mode Master -vlnv xilinx.com:display_aurora:GT_Serial_Transceiver_Pins_TX_rtl:1.0 GT_SERIAL_TX_0
create_bd_intf_pin -mode Slave -vlnv xilinx.com:display_aurora:GT_Serial_Transceiver_Pins_RX_rtl:1.0 GT_SERIAL_RX_0
create_bd_pin -dir O -type clk USER_CLK_O
create_bd_pin -dir I -type clk SYS_CLK
create_bd_pin -dir I -type rst resetn
create_bd_pin -dir O hard_err
create_bd_pin -dir O soft_err
create_bd_pin -dir O frame_err
create_bd_pin -dir O channel_up
create_bd_pin -dir O -from 0 -to 0 lane_up
create_bd_pin -dir I -type rst gt_reset
create_bd_pin -dir I -from 0 -to 0 loopback
create_bd_pin -dir O crc_valid
create_bd_pin -dir O crc_pass_fail_n
create_bd_pin -dir I -type rst power_down
create_bd_pin -dir O tx_lock
create_bd_pin -dir O tx_resetdone_out
create_bd_pin -dir O rx_resetdone_out
create_bd_pin -dir O -type rst link_reset_out
create_bd_pin -dir I -type clk init_clk_in
create_bd_pin -dir O pll_not_locked_out
create_bd_pin -dir O -type rst sys_reset_out
create_bd_pin -dir O -type clk sync_clk_out
create_bd_pin -dir O -type rst gt_reset_out
create_bd_pin -dir O -type clk gt_refclk1_out
create_bd_pin -dir O -from 0 -to 0 gt_powergood
create_bd_pin -dir I -type rst rst_i

create_bd_cell -type ip -vlnv xilinx.com:ip:fifo_generator:13.2 IN_CDC_GTH0_A
set_property -dict [list \
  CONFIG.Clock_Type_AXI Independent_Clock \
  CONFIG.Enable_TLAST true \
  CONFIG.HAS_TKEEP true \
  CONFIG.INTERFACE_TYPE AXI_STREAM \
  CONFIG.TDATA_NUM_BYTES 4 \
  CONFIG.TUSER_WIDTH 0 \
] [get_bd_cells IN_CDC_GTH0_A]
create_bd_cell -type ip -vlnv xilinx.com:ip:aurora_8b10b:11.1 aurora_8b10b_GTH0_A
set_property -dict [list \
  CONFIG.C_DRP_IF false \
  CONFIG.C_LANE_WIDTH 4 \
  CONFIG.C_LINE_RATE 6.25 \
  CONFIG.C_REFCLK_SOURCE {MGTREFCLK1 of Quad X0Y1} \
  CONFIG.C_USE_CRC true \
  CONFIG.Flow_Mode None \
  CONFIG.SupportLevel 1 \
] [get_bd_cells aurora_8b10b_GTH0_A]
create_bd_cell -type ip -vlnv xilinx.com:ip:fifo_generator:13.2 OUT_CDC_GTH0_A
set_property -dict [list \
  CONFIG.Clock_Type_AXI Independent_Clock \
  CONFIG.Enable_TLAST true \
  CONFIG.HAS_TKEEP true \
  CONFIG.INTERFACE_TYPE AXI_STREAM \
  CONFIG.TDATA_NUM_BYTES 4 \
  CONFIG.TUSER_WIDTH 0 \
] [get_bd_cells OUT_CDC_GTH0_A]
create_bd_cell -type ip -vlnv xilinx.com:ip:system_ila:1.1 ILA_GTHA
set_property -dict [list \
  CONFIG.C_MON_TYPE MIX \
  CONFIG.C_NUM_MONITOR_SLOTS 1 \
  CONFIG.C_NUM_OF_PROBES 15 \
  CONFIG.C_PROBE0_TYPE 0 \
  CONFIG.C_PROBE10_TYPE 0 \
  CONFIG.C_PROBE11_TYPE 0 \
  CONFIG.C_PROBE12_TYPE 0 \
  CONFIG.C_PROBE13_TYPE 0 \
  CONFIG.C_PROBE14_TYPE 0 \
  CONFIG.C_PROBE1_TYPE 0 \
  CONFIG.C_PROBE2_TYPE 0 \
  CONFIG.C_PROBE3_TYPE 0 \
  CONFIG.C_PROBE4_TYPE 0 \
  CONFIG.C_PROBE5_TYPE 0 \
  CONFIG.C_PROBE6_TYPE 0 \
  CONFIG.C_PROBE7_TYPE 0 \
  CONFIG.C_PROBE8_TYPE 0 \
  CONFIG.C_PROBE9_TYPE 0 \
  CONFIG.C_SLOT_0_APC_EN 0 \
  CONFIG.C_SLOT_0_AXI_DATA_SEL 1 \
  CONFIG.C_SLOT_0_AXI_TRIG_SEL 1 \
  CONFIG.C_SLOT_0_INTF_TYPE xilinx.com:interface:axis_rtl:1.0 \
] [get_bd_cells ILA_GTHA]

# ---- hierarchy /AURORA/GTHD ----
current_bd_instance /AURORA/GTHD
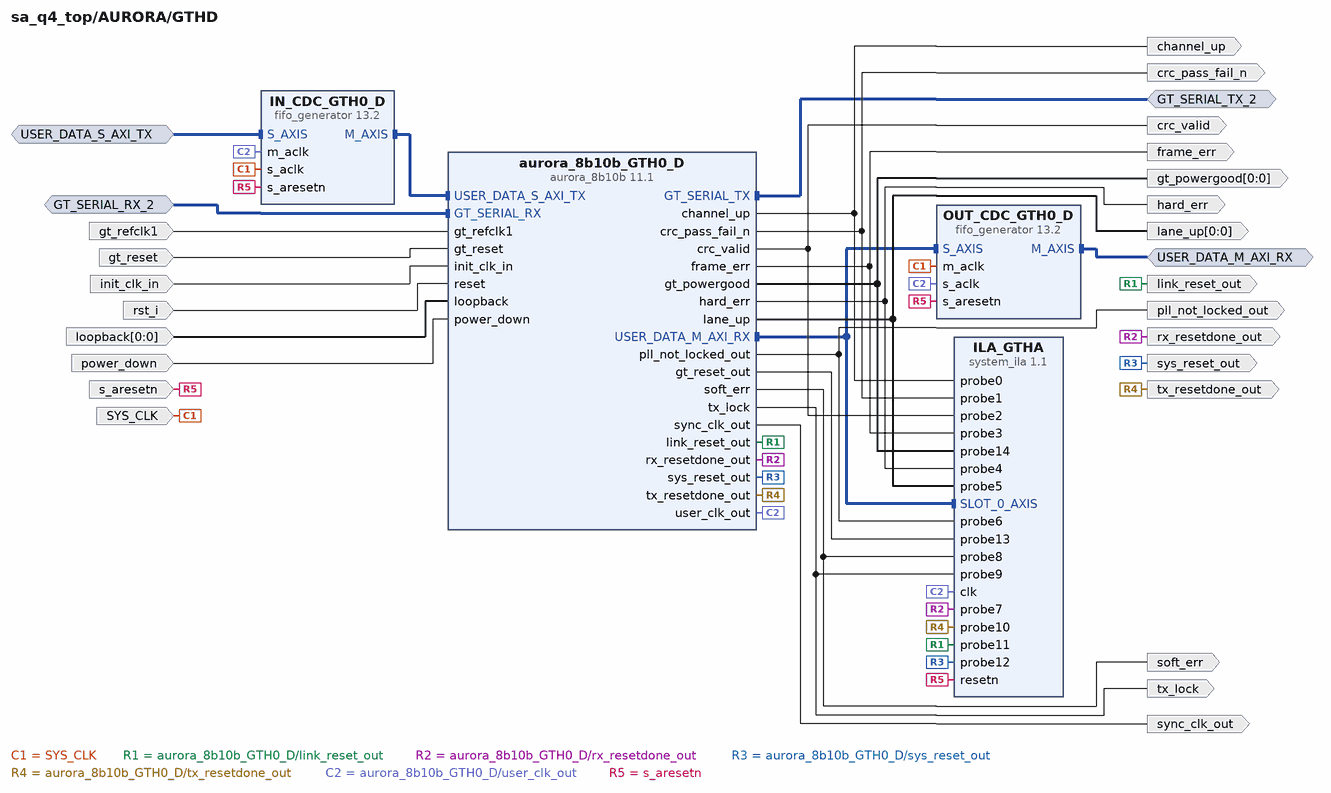
[diagram p6: block diagram inside /AURORA/GTHD]
create_bd_intf_pin -mode Slave -vlnv xilinx.com:interface:axis_rtl:1.0 USER_DATA_S_AXI_TX
create_bd_intf_pin -mode Master -vlnv xilinx.com:interface:axis_rtl:1.0 USER_DATA_M_AXI_RX
create_bd_intf_pin -mode Master -vlnv xilinx.com:display_aurora:GT_Serial_Transceiver_Pins_TX_rtl:1.0 GT_SERIAL_TX_2
create_bd_intf_pin -mode Slave -vlnv xilinx.com:display_aurora:GT_Serial_Transceiver_Pins_RX_rtl:1.0 GT_SERIAL_RX_2
create_bd_pin -dir O hard_err
create_bd_pin -dir O soft_err
create_bd_pin -dir O frame_err
create_bd_pin -dir O channel_up
create_bd_pin -dir O -from 0 -to 0 lane_up
create_bd_pin -dir I rst_i
create_bd_pin -dir I -type rst gt_reset
create_bd_pin -dir I -from 0 -to 0 loopback
create_bd_pin -dir O crc_valid
create_bd_pin -dir O crc_pass_fail_n
create_bd_pin -dir I -type rst power_down
create_bd_pin -dir O tx_lock
create_bd_pin -dir O tx_resetdone_out
create_bd_pin -dir O rx_resetdone_out
create_bd_pin -dir O -type rst link_reset_out
create_bd_pin -dir I -type clk init_clk_in
create_bd_pin -dir O pll_not_locked_out
create_bd_pin -dir O -type rst sys_reset_out
create_bd_pin -dir I -type clk gt_refclk1
create_bd_pin -dir O -type clk sync_clk_out
create_bd_pin -dir O -from 0 -to 0 gt_powergood
create_bd_pin -dir I SYS_CLK
create_bd_pin -dir I s_aresetn

create_bd_cell -type ip -vlnv xilinx.com:ip:aurora_8b10b:11.1 aurora_8b10b_GTH0_D
set_property -dict [list \
  CONFIG.C_DRP_IF false \
  CONFIG.C_LANE_WIDTH 4 \
  CONFIG.C_LINE_RATE 6.25 \
  CONFIG.C_REFCLK_SOURCE {MGTREFCLK1 of Quad X0Y1} \
  CONFIG.C_START_LANE X0Y7 \
  CONFIG.C_USE_CRC true \
  CONFIG.Flow_Mode None \
  CONFIG.SINGLEEND_GTREFCLK true \
  CONFIG.SupportLevel 1 \
] [get_bd_cells aurora_8b10b_GTH0_D]
create_bd_cell -type ip -vlnv xilinx.com:ip:fifo_generator:13.2 IN_CDC_GTH0_D
set_property -dict [list \
  CONFIG.Clock_Type_AXI Independent_Clock \
  CONFIG.Enable_TLAST true \
  CONFIG.HAS_TKEEP true \
  CONFIG.INTERFACE_TYPE AXI_STREAM \
  CONFIG.TDATA_NUM_BYTES 4 \
  CONFIG.TUSER_WIDTH 0 \
] [get_bd_cells IN_CDC_GTH0_D]
create_bd_cell -type ip -vlnv xilinx.com:ip:fifo_generator:13.2 OUT_CDC_GTH0_D
set_property -dict [list \
  CONFIG.Clock_Type_AXI Independent_Clock \
  CONFIG.Enable_TLAST true \
  CONFIG.HAS_TKEEP true \
  CONFIG.INTERFACE_TYPE AXI_STREAM \
  CONFIG.TDATA_NUM_BYTES 4 \
  CONFIG.TUSER_WIDTH 0 \
] [get_bd_cells OUT_CDC_GTH0_D]
create_bd_cell -type ip -vlnv xilinx.com:ip:system_ila:1.1 ILA_GTHA
set_property -dict [list \
  CONFIG.C_MON_TYPE MIX \
  CONFIG.C_NUM_MONITOR_SLOTS 1 \
  CONFIG.C_NUM_OF_PROBES 15 \
  CONFIG.C_PROBE0_TYPE 0 \
  CONFIG.C_PROBE10_TYPE 0 \
  CONFIG.C_PROBE11_TYPE 0 \
  CONFIG.C_PROBE12_TYPE 0 \
  CONFIG.C_PROBE13_TYPE 0 \
  CONFIG.C_PROBE14_TYPE 0 \
  CONFIG.C_PROBE1_TYPE 0 \
  CONFIG.C_PROBE2_TYPE 0 \
  CONFIG.C_PROBE3_TYPE 0 \
  CONFIG.C_PROBE4_TYPE 0 \
  CONFIG.C_PROBE5_TYPE 0 \
  CONFIG.C_PROBE6_TYPE 0 \
  CONFIG.C_PROBE7_TYPE 0 \
  CONFIG.C_PROBE8_TYPE 0 \
  CONFIG.C_PROBE9_TYPE 0 \
  CONFIG.C_SLOT_0_APC_EN 0 \
  CONFIG.C_SLOT_0_AXI_DATA_SEL 1 \
  CONFIG.C_SLOT_0_AXI_TRIG_SEL 1 \
  CONFIG.C_SLOT_0_INTF_TYPE xilinx.com:interface:axis_rtl:1.0 \
] [get_bd_cells ILA_GTHA]

# ---- hierarchy /Project ----
current_bd_instance /Project
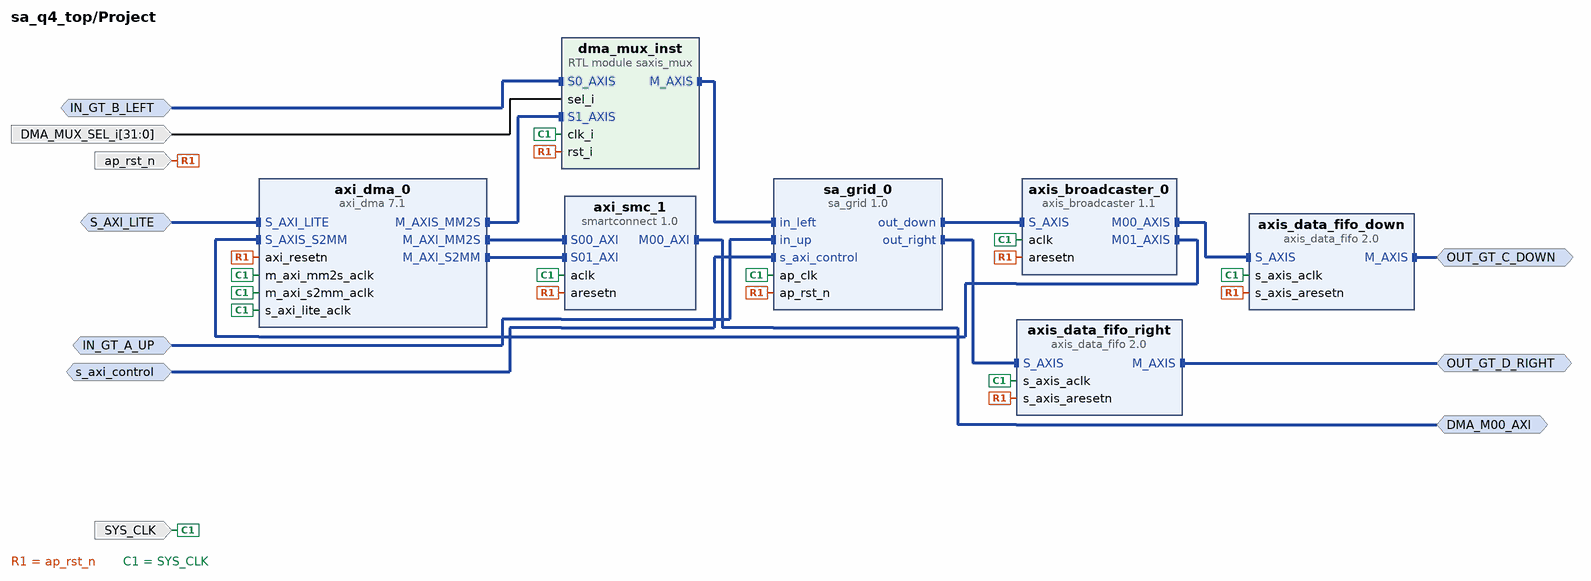
[diagram p7: block diagram inside /Project]
create_bd_intf_pin -mode Slave -vlnv xilinx.com:interface:axis_rtl:1.0 IN_GT_B_LEFT
create_bd_intf_pin -mode Slave -vlnv xilinx.com:interface:axis_rtl:1.0 IN_GT_A_UP
create_bd_intf_pin -mode Master -vlnv xilinx.com:interface:aximm_rtl:1.0 DMA_M00_AXI
create_bd_intf_pin -mode Master -vlnv xilinx.com:interface:axis_rtl:1.0 OUT_GT_C_DOWN
create_bd_intf_pin -mode Master -vlnv xilinx.com:interface:axis_rtl:1.0 OUT_GT_D_RIGHT
create_bd_intf_pin -mode Slave -vlnv xilinx.com:interface:aximm_rtl:1.0 s_axi_control
create_bd_intf_pin -mode Slave -vlnv xilinx.com:interface:aximm_rtl:1.0 S_AXI_LITE
create_bd_pin -dir I -type clk SYS_CLK
create_bd_pin -dir I -type rst ap_rst_n
create_bd_pin -dir I -from 31 -to 0 DMA_MUX_SEL_i

create_bd_cell -type ip -vlnv xilinx.com:ip:axis_broadcaster:1.1 axis_broadcaster_0
set_property -dict [list \
  CONFIG.HAS_TKEEP 1 \
  CONFIG.HAS_TLAST 1 \
  CONFIG.HAS_TREADY 1 \
  CONFIG.HAS_TSTRB 1 \
  CONFIG.M_TDATA_NUM_BYTES 4 \
  CONFIG.M_TUSER_WIDTH 0 \
  CONFIG.S_TDATA_NUM_BYTES 4 \
  CONFIG.S_TUSER_WIDTH 0 \
  CONFIG.TDEST_WIDTH 0 \
  CONFIG.TID_WIDTH 0 \
] [get_bd_cells axis_broadcaster_0]
create_bd_cell -type module -reference saxis_mux dma_mux_inst
create_bd_cell -type ip -vlnv xilinx.com:hls:sa_grid:1.0 sa_grid_0
create_bd_cell -type ip -vlnv xilinx.com:ip:smartconnect:1.0 axi_smc_1
set_property -dict {CONFIG.NUM_SI 2} [get_bd_cells axi_smc_1]
create_bd_cell -type ip -vlnv xilinx.com:ip:axis_data_fifo:2.0 axis_data_fifo_down
set_property -dict [list \
  CONFIG.FIFO_DEPTH 32 \
  CONFIG.HAS_TKEEP 1 \
  CONFIG.HAS_TLAST 1 \
  CONFIG.HAS_TSTRB 1 \
  CONFIG.TDATA_NUM_BYTES 4 \
] [get_bd_cells axis_data_fifo_down]
create_bd_cell -type ip -vlnv xilinx.com:ip:axis_data_fifo:2.0 axis_data_fifo_right
set_property -dict [list \
  CONFIG.FIFO_DEPTH 32 \
  CONFIG.HAS_TKEEP 1 \
  CONFIG.HAS_TLAST 1 \
  CONFIG.HAS_TSTRB 1 \
  CONFIG.TDATA_NUM_BYTES 4 \
] [get_bd_cells axis_data_fifo_right]
create_bd_cell -type ip -vlnv xilinx.com:ip:axi_dma:7.1 axi_dma_0
set_property -dict {CONFIG.c_addr_width 40 CONFIG.c_include_sg 0 CONFIG.c_sg_length_width 26} [get_bd_cells axi_dma_0]

# ---- connections ----

current_bd_instance /AURORA
connect_bd_intf_net [get_bd_intf_pins GTHA/GT_SERIAL_RX_0] [get_bd_intf_pins GT_SERIAL_RX_0]
connect_bd_intf_net [get_bd_intf_pins GTHA/GT_SERIAL_TX_0] [get_bd_intf_pins GT_SERIAL_TX_0]
connect_bd_intf_net [get_bd_intf_pins GTHB/GT_SERIAL_RX_1] [get_bd_intf_pins GT_SERIAL_RX_1]
connect_bd_intf_net [get_bd_intf_pins GTHB/GT_SERIAL_TX_1] [get_bd_intf_pins GT_SERIAL_TX_1]
connect_bd_intf_net [get_bd_intf_pins GTHD/GT_SERIAL_RX_2] [get_bd_intf_pins GT_SERIAL_RX_2]
connect_bd_intf_net [get_bd_intf_pins GTHD/GT_SERIAL_TX_2] [get_bd_intf_pins GT_SERIAL_TX_2]
connect_bd_intf_net [get_bd_intf_pins GTHC/GT_SERIAL_RX_3] [get_bd_intf_pins GT_SERIAL_RX_3]
connect_bd_intf_net [get_bd_intf_pins GTHC/GT_SERIAL_TX_3] [get_bd_intf_pins GT_SERIAL_TX_3]
connect_bd_intf_net [get_bd_intf_pins GTHA/GT_DIFF_REFCLK1_0] [get_bd_intf_pins GT_DIFF_REFCLK1_0]
connect_bd_intf_net [get_bd_intf_pins GTHD/USER_DATA_S_AXI_TX] [get_bd_intf_pins IN_GT_D_RIGHT]
connect_bd_intf_net [get_bd_intf_pins GTHB/USER_DATA_S_AXI_TX] [get_bd_intf_pins IN_GT_B_LEFT]
connect_bd_intf_net [get_bd_intf_pins GTHA/S_AXIS] [get_bd_intf_pins IN_GT_A_UP]
connect_bd_intf_net [get_bd_intf_pins GTHA/USER_DATA_M_AXI_RX] [get_bd_intf_pins OUT_GT_A_UP]
connect_bd_intf_net [get_bd_intf_pins GTHB/USER_DATA_M_AXI_RX] [get_bd_intf_pins OUT_GT_B_LEFT]
connect_bd_intf_net [get_bd_intf_pins GTHC/USER_DATA_M_AXI_RX] [get_bd_intf_pins OUT_GT_C_DOWN]
connect_bd_intf_net [get_bd_intf_pins GTHD/USER_DATA_M_AXI_RX] [get_bd_intf_pins OUT_GT_D_RIGHT]
connect_bd_intf_net [get_bd_intf_pins STATUS_REG/s00_axi] [get_bd_intf_pins s00_axi]
connect_bd_intf_net [get_bd_intf_pins IN_GT_C_DOWN] [get_bd_intf_pins GTHC/S_AXIS]
connect_bd_net -net aurora_8b10b_GTH0_A_channel_up [get_bd_pins GTHA/channel_up] [get_bd_pins STATUS_REG/static_in_00]
connect_bd_net -net aurora_8b10b_GTH0_A_crc_pass_fail_n [get_bd_pins GTHA/crc_pass_fail_n] [get_bd_pins STATUS_REG/static_in_01]
connect_bd_net -net aurora_8b10b_GTH0_A_crc_valid [get_bd_pins GTHA/crc_valid] [get_bd_pins STATUS_REG/static_in_02]
connect_bd_net -net aurora_8b10b_GTH0_A_frame_err [get_bd_pins GTHA/frame_err] [get_bd_pins STATUS_REG/static_in_03]
connect_bd_net -net aurora_8b10b_GTH0_A_gt_powergood [get_bd_pins GTHA/gt_powergood] [get_bd_pins STATUS_REG/static_in_14]
connect_bd_net -net aurora_8b10b_GTH0_A_gt_refclk1_out [get_bd_pins GTHA/gt_refclk1_out] \
  [get_bd_pins GTHB/gt_refclk1] [get_bd_pins GTHC/gt_refclk1] [get_bd_pins GTHD/gt_refclk1]
connect_bd_net -net aurora_8b10b_GTH0_A_gt_reset_out [get_bd_pins GTHA/gt_reset_out] \
  [get_bd_pins GTHB/gt_reset] [get_bd_pins GTHC/gt_reset] [get_bd_pins GTHD/gt_reset]
connect_bd_net -net aurora_8b10b_GTH0_A_hard_err [get_bd_pins GTHA/hard_err] [get_bd_pins STATUS_REG/static_in_04]
connect_bd_net -net aurora_8b10b_GTH0_A_lane_up [get_bd_pins GTHA/lane_up] [get_bd_pins STATUS_REG/static_in_05]
connect_bd_net -net aurora_8b10b_GTH0_A_link_reset_out [get_bd_pins GTHA/link_reset_out] [get_bd_pins STATUS_REG/static_in_11]
connect_bd_net -net aurora_8b10b_GTH0_A_pll_not_locked_out [get_bd_pins GTHA/pll_not_locked_out] [get_bd_pins STATUS_REG/static_in_06]
connect_bd_net -net aurora_8b10b_GTH0_A_rx_resetdone_out [get_bd_pins GTHA/rx_resetdone_out] [get_bd_pins STATUS_REG/static_in_07]
connect_bd_net -net aurora_8b10b_GTH0_A_soft_err [get_bd_pins GTHA/soft_err] [get_bd_pins STATUS_REG/static_in_08]
connect_bd_net -net aurora_8b10b_GTH0_A_sync_clk_out [get_bd_pins GTHA/sync_clk_out] [get_bd_pins STATUS_REG/static_in_13]
connect_bd_net -net aurora_8b10b_GTH0_A_sys_reset_out [get_bd_pins GTHA/sys_reset_out] \
  [get_bd_pins STATUS_REG/static_in_12] [get_bd_pins GTHC/rst_i] [get_bd_pins GTHD/rst_i] [get_bd_pins GTHB/rst_i]
connect_bd_net -net aurora_8b10b_GTH0_A_tx_lock [get_bd_pins GTHA/tx_lock] [get_bd_pins STATUS_REG/static_in_09]
connect_bd_net -net aurora_8b10b_GTH0_A_tx_resetdone_out [get_bd_pins GTHA/tx_resetdone_out] [get_bd_pins STATUS_REG/static_in_10]
connect_bd_net -net aurora_8b10b_GTH0_A_user_clk_out [get_bd_pins GTHA/USER_CLK_O] [get_bd_pins STATUS_REG/USER_CLK_O]
connect_bd_net -net aurora_8b10b_GTH0_B_channel_up [get_bd_pins GTHB/channel_up] [get_bd_pins STATUS_REG/static_in_15]
connect_bd_net -net aurora_8b10b_GTH0_B_crc_pass_fail_n [get_bd_pins GTHB/crc_pass_fail_n] [get_bd_pins STATUS_REG/static_in_16]
connect_bd_net -net aurora_8b10b_GTH0_B_crc_valid [get_bd_pins GTHB/crc_valid] [get_bd_pins STATUS_REG/static_in_17]
connect_bd_net -net aurora_8b10b_GTH0_B_frame_err [get_bd_pins GTHB/frame_err] [get_bd_pins STATUS_REG/static_in_18]
connect_bd_net -net aurora_8b10b_GTH0_B_gt_powergood [get_bd_pins GTHB/gt_powergood] [get_bd_pins STATUS_REG/static_in_29]
connect_bd_net -net aurora_8b10b_GTH0_B_hard_err [get_bd_pins GTHB/hard_err] [get_bd_pins STATUS_REG/static_in_19]
connect_bd_net -net aurora_8b10b_GTH0_B_lane_up [get_bd_pins GTHB/lane_up] [get_bd_pins STATUS_REG/static_in_20]
connect_bd_net -net aurora_8b10b_GTH0_B_link_reset_out [get_bd_pins GTHB/link_reset_out] [get_bd_pins STATUS_REG/static_in_26]
connect_bd_net -net aurora_8b10b_GTH0_B_pll_not_locked_out [get_bd_pins GTHB/pll_not_locked_out] [get_bd_pins STATUS_REG/static_in_21]
connect_bd_net -net aurora_8b10b_GTH0_B_rx_resetdone_out [get_bd_pins GTHB/rx_resetdone_out] [get_bd_pins STATUS_REG/static_in_22]
connect_bd_net -net aurora_8b10b_GTH0_B_soft_err [get_bd_pins GTHB/soft_err] [get_bd_pins STATUS_REG/static_in_23]
connect_bd_net -net aurora_8b10b_GTH0_B_sync_clk_out [get_bd_pins GTHB/sync_clk_out] [get_bd_pins STATUS_REG/static_in_28]
connect_bd_net -net aurora_8b10b_GTH0_B_sys_reset_out [get_bd_pins GTHB/sys_reset_out] [get_bd_pins STATUS_REG/static_in_27]
connect_bd_net -net aurora_8b10b_GTH0_B_tx_lock [get_bd_pins GTHB/tx_lock] [get_bd_pins STATUS_REG/static_in_24]
connect_bd_net -net aurora_8b10b_GTH0_B_tx_resetdone_out [get_bd_pins GTHB/tx_resetdone_out] [get_bd_pins STATUS_REG/static_in_25]
connect_bd_net -net aurora_8b10b_GTH0_C_channel_up [get_bd_pins GTHC/channel_up] [get_bd_pins STATUS_REG/static_in_30]
connect_bd_net -net aurora_8b10b_GTH0_C_crc_pass_fail_n [get_bd_pins GTHC/crc_pass_fail_n] [get_bd_pins STATUS_REG/static_in_31]
connect_bd_net -net aurora_8b10b_GTH0_C_crc_valid [get_bd_pins GTHC/crc_valid] [get_bd_pins STATUS_REG/static_in_32]
connect_bd_net -net aurora_8b10b_GTH0_C_frame_err [get_bd_pins GTHC/frame_err] [get_bd_pins STATUS_REG/static_in_33]
connect_bd_net -net aurora_8b10b_GTH0_C_gt_powergood [get_bd_pins GTHC/gt_powergood] [get_bd_pins STATUS_REG/static_in_44]
connect_bd_net -net aurora_8b10b_GTH0_C_hard_err [get_bd_pins GTHC/hard_err] [get_bd_pins STATUS_REG/static_in_34]
connect_bd_net -net aurora_8b10b_GTH0_C_lane_up [get_bd_pins GTHC/lane_up] [get_bd_pins STATUS_REG/static_in_35]
connect_bd_net -net aurora_8b10b_GTH0_C_link_reset_out [get_bd_pins GTHC/link_reset_out] [get_bd_pins STATUS_REG/static_in_41]
connect_bd_net -net aurora_8b10b_GTH0_C_pll_not_locked_out [get_bd_pins GTHC/pll_not_locked_out] [get_bd_pins STATUS_REG/static_in_36]
connect_bd_net -net aurora_8b10b_GTH0_C_rx_resetdone_out [get_bd_pins GTHC/rx_resetdone_out] [get_bd_pins STATUS_REG/static_in_37]
connect_bd_net -net aurora_8b10b_GTH0_C_soft_err [get_bd_pins GTHC/soft_err] [get_bd_pins STATUS_REG/static_in_38]
connect_bd_net -net aurora_8b10b_GTH0_C_sync_clk_out [get_bd_pins GTHC/sync_clk_out] [get_bd_pins STATUS_REG/static_in_43]
connect_bd_net -net aurora_8b10b_GTH0_C_sys_reset_out [get_bd_pins GTHC/sys_reset_out] [get_bd_pins STATUS_REG/static_in_42]
connect_bd_net -net aurora_8b10b_GTH0_C_tx_lock [get_bd_pins GTHC/tx_lock] [get_bd_pins STATUS_REG/static_in_39]
connect_bd_net -net aurora_8b10b_GTH0_C_tx_resetdone_out [get_bd_pins GTHC/tx_resetdone_out] [get_bd_pins STATUS_REG/static_in_40]
connect_bd_net -net aurora_8b10b_GTH0_D_channel_up [get_bd_pins GTHD/channel_up] [get_bd_pins STATUS_REG/static_in_45]
connect_bd_net -net aurora_8b10b_GTH0_D_crc_pass_fail_n [get_bd_pins GTHD/crc_pass_fail_n] [get_bd_pins STATUS_REG/static_in_46]
connect_bd_net -net aurora_8b10b_GTH0_D_crc_valid [get_bd_pins GTHD/crc_valid] [get_bd_pins STATUS_REG/static_in_47]
connect_bd_net -net aurora_8b10b_GTH0_D_frame_err [get_bd_pins GTHD/frame_err] [get_bd_pins STATUS_REG/static_in_48]
connect_bd_net -net aurora_8b10b_GTH0_D_gt_powergood [get_bd_pins GTHD/gt_powergood] [get_bd_pins STATUS_REG/static_in_59]
connect_bd_net -net aurora_8b10b_GTH0_D_hard_err [get_bd_pins GTHD/hard_err] [get_bd_pins STATUS_REG/static_in_49]
connect_bd_net -net aurora_8b10b_GTH0_D_lane_up [get_bd_pins GTHD/lane_up] [get_bd_pins STATUS_REG/static_in_50]
connect_bd_net -net aurora_8b10b_GTH0_D_link_reset_out [get_bd_pins GTHD/link_reset_out] [get_bd_pins STATUS_REG/static_in_56]
connect_bd_net -net aurora_8b10b_GTH0_D_pll_not_locked_out [get_bd_pins GTHD/pll_not_locked_out] [get_bd_pins STATUS_REG/static_in_51]
connect_bd_net -net aurora_8b10b_GTH0_D_rx_resetdone_out [get_bd_pins GTHD/rx_resetdone_out] [get_bd_pins STATUS_REG/static_in_52]
connect_bd_net -net aurora_8b10b_GTH0_D_soft_err [get_bd_pins GTHD/soft_err] [get_bd_pins STATUS_REG/static_in_53]
connect_bd_net -net aurora_8b10b_GTH0_D_sync_clk_out [get_bd_pins GTHD/sync_clk_out] [get_bd_pins STATUS_REG/static_in_58]
connect_bd_net -net aurora_8b10b_GTH0_D_sys_reset_out [get_bd_pins GTHD/sys_reset_out] [get_bd_pins STATUS_REG/static_in_57]
connect_bd_net -net aurora_8b10b_GTH0_D_tx_lock [get_bd_pins GTHD/tx_lock] [get_bd_pins STATUS_REG/static_in_54]
connect_bd_net -net aurora_8b10b_GTH0_D_tx_resetdone_out [get_bd_pins GTHD/tx_resetdone_out] [get_bd_pins STATUS_REG/static_in_55]
connect_bd_net [get_bd_pins clk_wiz_0/INIT_CLK] \
  [get_bd_pins vio_0/clk] [get_bd_pins GTHA/init_clk_in] [get_bd_pins GTHC/init_clk_in] [get_bd_pins GTHD/init_clk_in] \
  [get_bd_pins GTHB/init_clk_in] [get_bd_pins STATUS_REG/clk_out_i] [get_bd_pins gt_reset_0/clk_i]
connect_bd_net [get_bd_pins gt_reset_0/rst_o] [get_bd_pins GTHA/gt_reset]
connect_bd_net [get_bd_pins resetn] \
  [get_bd_pins clk_wiz_0/resetn] [get_bd_pins STATUS_REG/resetn] [get_bd_pins GTHA/resetn] [get_bd_pins GTHC/resetn] \
  [get_bd_pins GTHD/s_aresetn] [get_bd_pins GTHB/resetn]
connect_bd_net [get_bd_pins rst_i] [get_bd_pins GTHA/rst_i] [get_bd_pins gt_reset_0/rst_i]
connect_bd_net -net s_aclk_0_1 [get_bd_pins SYS_CLK] \
  [get_bd_pins clk_wiz_0/clk_in1] [get_bd_pins STATUS_REG/clk_in1] [get_bd_pins GTHA/SYS_CLK] [get_bd_pins GTHC/SYS_CLK] \
  [get_bd_pins GTHD/SYS_CLK] [get_bd_pins GTHB/SYS_CLK]
connect_bd_net [get_bd_pins vio_0/probe_out0] \
  [get_bd_pins GTHA/loopback] [get_bd_pins GTHC/loopback] [get_bd_pins GTHD/loopback] [get_bd_pins GTHB/loopback]
connect_bd_net [get_bd_pins vio_0/probe_out1] \
  [get_bd_pins GTHA/power_down] [get_bd_pins GTHC/power_down] [get_bd_pins GTHD/power_down] [get_bd_pins GTHB/power_down]
set_property HDL_ATTRIBUTE.DEBUG true [get_bd_nets aurora_8b10b_GTH0_A_channel_up]
set_property HDL_ATTRIBUTE.DEBUG true [get_bd_nets aurora_8b10b_GTH0_A_crc_pass_fail_n]
set_property HDL_ATTRIBUTE.DEBUG true [get_bd_nets aurora_8b10b_GTH0_A_crc_valid]
set_property HDL_ATTRIBUTE.DEBUG true [get_bd_nets aurora_8b10b_GTH0_A_frame_err]
set_property HDL_ATTRIBUTE.DEBUG true [get_bd_nets aurora_8b10b_GTH0_A_gt_powergood]
set_property HDL_ATTRIBUTE.DEBUG true [get_bd_nets aurora_8b10b_GTH0_A_gt_reset_out]
set_property HDL_ATTRIBUTE.DEBUG true [get_bd_nets aurora_8b10b_GTH0_A_hard_err]
set_property HDL_ATTRIBUTE.DEBUG true [get_bd_nets aurora_8b10b_GTH0_A_lane_up]
set_property HDL_ATTRIBUTE.DEBUG true [get_bd_nets aurora_8b10b_GTH0_A_link_reset_out]
set_property HDL_ATTRIBUTE.DEBUG true [get_bd_nets aurora_8b10b_GTH0_A_pll_not_locked_out]
set_property HDL_ATTRIBUTE.DEBUG true [get_bd_nets aurora_8b10b_GTH0_A_rx_resetdone_out]
set_property HDL_ATTRIBUTE.DEBUG true [get_bd_nets aurora_8b10b_GTH0_A_soft_err]
set_property HDL_ATTRIBUTE.DEBUG true [get_bd_nets aurora_8b10b_GTH0_A_sys_reset_out]
set_property HDL_ATTRIBUTE.DEBUG true [get_bd_nets aurora_8b10b_GTH0_A_tx_lock]
set_property HDL_ATTRIBUTE.DEBUG true [get_bd_nets aurora_8b10b_GTH0_A_tx_resetdone_out]

current_bd_instance /AURORA/STATUS_REG
connect_bd_intf_net [get_bd_intf_pins s00_axi] [get_bd_intf_pins axil_static_regs_vhd_0/s00_axi]
connect_bd_net -net INIT_CLK_result_o [get_bd_pins INIT_CLK/result_o] \
  [get_bd_pins system_ila_0/probe0] [get_bd_pins axil_static_regs_vhd_0/static_in_89]
connect_bd_net -net SYS_CLK_result_o [get_bd_pins SYS_CLK/result_o] \
  [get_bd_pins system_ila_0/probe1] [get_bd_pins axil_static_regs_vhd_0/static_in_90]
connect_bd_net [get_bd_pins USER_CLK_O] [get_bd_pins USER_CLK/clk_meas_i]
connect_bd_net -net USER_CLK_result_o [get_bd_pins USER_CLK/result_o] \
  [get_bd_pins system_ila_0/probe2] [get_bd_pins axil_static_regs_vhd_0/static_in_91]
connect_bd_net -net aurora_8b10b_GTH0_A_channel_up [get_bd_pins static_in_00] [get_bd_pins axil_static_regs_vhd_0/static_in_00]
connect_bd_net -net aurora_8b10b_GTH0_A_crc_pass_fail_n [get_bd_pins static_in_01] [get_bd_pins axil_static_regs_vhd_0/static_in_01]
connect_bd_net -net aurora_8b10b_GTH0_A_crc_valid [get_bd_pins static_in_02] [get_bd_pins axil_static_regs_vhd_0/static_in_02]
connect_bd_net -net aurora_8b10b_GTH0_A_frame_err [get_bd_pins static_in_03] [get_bd_pins axil_static_regs_vhd_0/static_in_03]
connect_bd_net -net aurora_8b10b_GTH0_A_gt_powergood [get_bd_pins static_in_14] [get_bd_pins axil_static_regs_vhd_0/static_in_14]
connect_bd_net -net aurora_8b10b_GTH0_A_hard_err [get_bd_pins static_in_04] [get_bd_pins axil_static_regs_vhd_0/static_in_04]
connect_bd_net -net aurora_8b10b_GTH0_A_lane_up [get_bd_pins static_in_05] [get_bd_pins axil_static_regs_vhd_0/static_in_05]
connect_bd_net -net aurora_8b10b_GTH0_A_link_reset_out [get_bd_pins static_in_11] [get_bd_pins axil_static_regs_vhd_0/static_in_11]
connect_bd_net -net aurora_8b10b_GTH0_A_pll_not_locked_out [get_bd_pins static_in_06] [get_bd_pins axil_static_regs_vhd_0/static_in_06]
connect_bd_net -net aurora_8b10b_GTH0_A_rx_resetdone_out [get_bd_pins static_in_07] [get_bd_pins axil_static_regs_vhd_0/static_in_07]
connect_bd_net -net aurora_8b10b_GTH0_A_soft_err [get_bd_pins static_in_08] [get_bd_pins axil_static_regs_vhd_0/static_in_08]
connect_bd_net -net aurora_8b10b_GTH0_A_sync_clk_out [get_bd_pins static_in_13] [get_bd_pins axil_static_regs_vhd_0/static_in_13]
connect_bd_net -net aurora_8b10b_GTH0_A_sys_reset_out [get_bd_pins static_in_12] \
  [get_bd_pins INIT_CLK/rst_i] [get_bd_pins SYS_CLK/rst_i] [get_bd_pins axil_static_regs_vhd_0/static_in_12] \
  [get_bd_pins USER_CLK/rst_i]
connect_bd_net -net aurora_8b10b_GTH0_A_tx_lock [get_bd_pins static_in_09] [get_bd_pins axil_static_regs_vhd_0/static_in_09]
connect_bd_net -net aurora_8b10b_GTH0_A_tx_resetdone_out [get_bd_pins static_in_10] [get_bd_pins axil_static_regs_vhd_0/static_in_10]
connect_bd_net -net aurora_8b10b_GTH0_B_channel_up [get_bd_pins static_in_15] [get_bd_pins axil_static_regs_vhd_0/static_in_15]
connect_bd_net -net aurora_8b10b_GTH0_B_crc_pass_fail_n [get_bd_pins static_in_16] [get_bd_pins axil_static_regs_vhd_0/static_in_16]
connect_bd_net -net aurora_8b10b_GTH0_B_crc_valid [get_bd_pins static_in_17] [get_bd_pins axil_static_regs_vhd_0/static_in_17]
connect_bd_net -net aurora_8b10b_GTH0_B_frame_err [get_bd_pins static_in_18] [get_bd_pins axil_static_regs_vhd_0/static_in_18]
connect_bd_net -net aurora_8b10b_GTH0_B_gt_powergood [get_bd_pins static_in_29] [get_bd_pins axil_static_regs_vhd_0/static_in_29]
connect_bd_net -net aurora_8b10b_GTH0_B_hard_err [get_bd_pins static_in_19] [get_bd_pins axil_static_regs_vhd_0/static_in_19]
connect_bd_net -net aurora_8b10b_GTH0_B_lane_up [get_bd_pins static_in_20] [get_bd_pins axil_static_regs_vhd_0/static_in_20]
connect_bd_net -net aurora_8b10b_GTH0_B_link_reset_out [get_bd_pins static_in_26] [get_bd_pins axil_static_regs_vhd_0/static_in_26]
connect_bd_net -net aurora_8b10b_GTH0_B_pll_not_locked_out [get_bd_pins static_in_21] [get_bd_pins axil_static_regs_vhd_0/static_in_21]
connect_bd_net -net aurora_8b10b_GTH0_B_rx_resetdone_out [get_bd_pins static_in_22] [get_bd_pins axil_static_regs_vhd_0/static_in_22]
connect_bd_net -net aurora_8b10b_GTH0_B_soft_err [get_bd_pins static_in_23] [get_bd_pins axil_static_regs_vhd_0/static_in_23]
connect_bd_net -net aurora_8b10b_GTH0_B_sync_clk_out [get_bd_pins static_in_28] [get_bd_pins axil_static_regs_vhd_0/static_in_28]
connect_bd_net -net aurora_8b10b_GTH0_B_sys_reset_out [get_bd_pins static_in_27] [get_bd_pins axil_static_regs_vhd_0/static_in_27]
connect_bd_net -net aurora_8b10b_GTH0_B_tx_lock [get_bd_pins static_in_24] [get_bd_pins axil_static_regs_vhd_0/static_in_24]
connect_bd_net -net aurora_8b10b_GTH0_B_tx_resetdone_out [get_bd_pins static_in_25] [get_bd_pins axil_static_regs_vhd_0/static_in_25]
connect_bd_net -net aurora_8b10b_GTH0_C_channel_up [get_bd_pins static_in_30] [get_bd_pins axil_static_regs_vhd_0/static_in_30]
connect_bd_net -net aurora_8b10b_GTH0_C_crc_pass_fail_n [get_bd_pins static_in_31] [get_bd_pins axil_static_regs_vhd_0/static_in_31]
connect_bd_net -net aurora_8b10b_GTH0_C_crc_valid [get_bd_pins static_in_32] [get_bd_pins axil_static_regs_vhd_0/static_in_32]
connect_bd_net -net aurora_8b10b_GTH0_C_frame_err [get_bd_pins static_in_33] [get_bd_pins axil_static_regs_vhd_0/static_in_33]
connect_bd_net -net aurora_8b10b_GTH0_C_gt_powergood [get_bd_pins static_in_44] [get_bd_pins axil_static_regs_vhd_0/static_in_44]
connect_bd_net -net aurora_8b10b_GTH0_C_hard_err [get_bd_pins static_in_34] [get_bd_pins axil_static_regs_vhd_0/static_in_34]
connect_bd_net -net aurora_8b10b_GTH0_C_lane_up [get_bd_pins static_in_35] [get_bd_pins axil_static_regs_vhd_0/static_in_35]
connect_bd_net -net aurora_8b10b_GTH0_C_link_reset_out [get_bd_pins static_in_41] [get_bd_pins axil_static_regs_vhd_0/static_in_41]
connect_bd_net -net aurora_8b10b_GTH0_C_pll_not_locked_out [get_bd_pins static_in_36] [get_bd_pins axil_static_regs_vhd_0/static_in_36]
connect_bd_net -net aurora_8b10b_GTH0_C_rx_resetdone_out [get_bd_pins static_in_37] [get_bd_pins axil_static_regs_vhd_0/static_in_37]
connect_bd_net -net aurora_8b10b_GTH0_C_soft_err [get_bd_pins static_in_38] [get_bd_pins axil_static_regs_vhd_0/static_in_38]
connect_bd_net -net aurora_8b10b_GTH0_C_sync_clk_out [get_bd_pins static_in_43] [get_bd_pins axil_static_regs_vhd_0/static_in_43]
connect_bd_net -net aurora_8b10b_GTH0_C_sys_reset_out [get_bd_pins static_in_42] [get_bd_pins axil_static_regs_vhd_0/static_in_42]
connect_bd_net -net aurora_8b10b_GTH0_C_tx_lock [get_bd_pins static_in_39] [get_bd_pins axil_static_regs_vhd_0/static_in_39]
connect_bd_net -net aurora_8b10b_GTH0_C_tx_resetdone_out [get_bd_pins static_in_40] [get_bd_pins axil_static_regs_vhd_0/static_in_40]
connect_bd_net -net aurora_8b10b_GTH0_D_channel_up [get_bd_pins static_in_45] [get_bd_pins axil_static_regs_vhd_0/static_in_45]
connect_bd_net -net aurora_8b10b_GTH0_D_crc_pass_fail_n [get_bd_pins static_in_46] [get_bd_pins axil_static_regs_vhd_0/static_in_46]
connect_bd_net -net aurora_8b10b_GTH0_D_crc_valid [get_bd_pins static_in_47] [get_bd_pins axil_static_regs_vhd_0/static_in_47]
connect_bd_net -net aurora_8b10b_GTH0_D_frame_err [get_bd_pins static_in_48] [get_bd_pins axil_static_regs_vhd_0/static_in_48]
connect_bd_net -net aurora_8b10b_GTH0_D_gt_powergood [get_bd_pins static_in_59] [get_bd_pins axil_static_regs_vhd_0/static_in_59]
connect_bd_net -net aurora_8b10b_GTH0_D_hard_err [get_bd_pins static_in_49] [get_bd_pins axil_static_regs_vhd_0/static_in_49]
